# Altium project TEBF0808.PrjPCB (part 1 of 6)
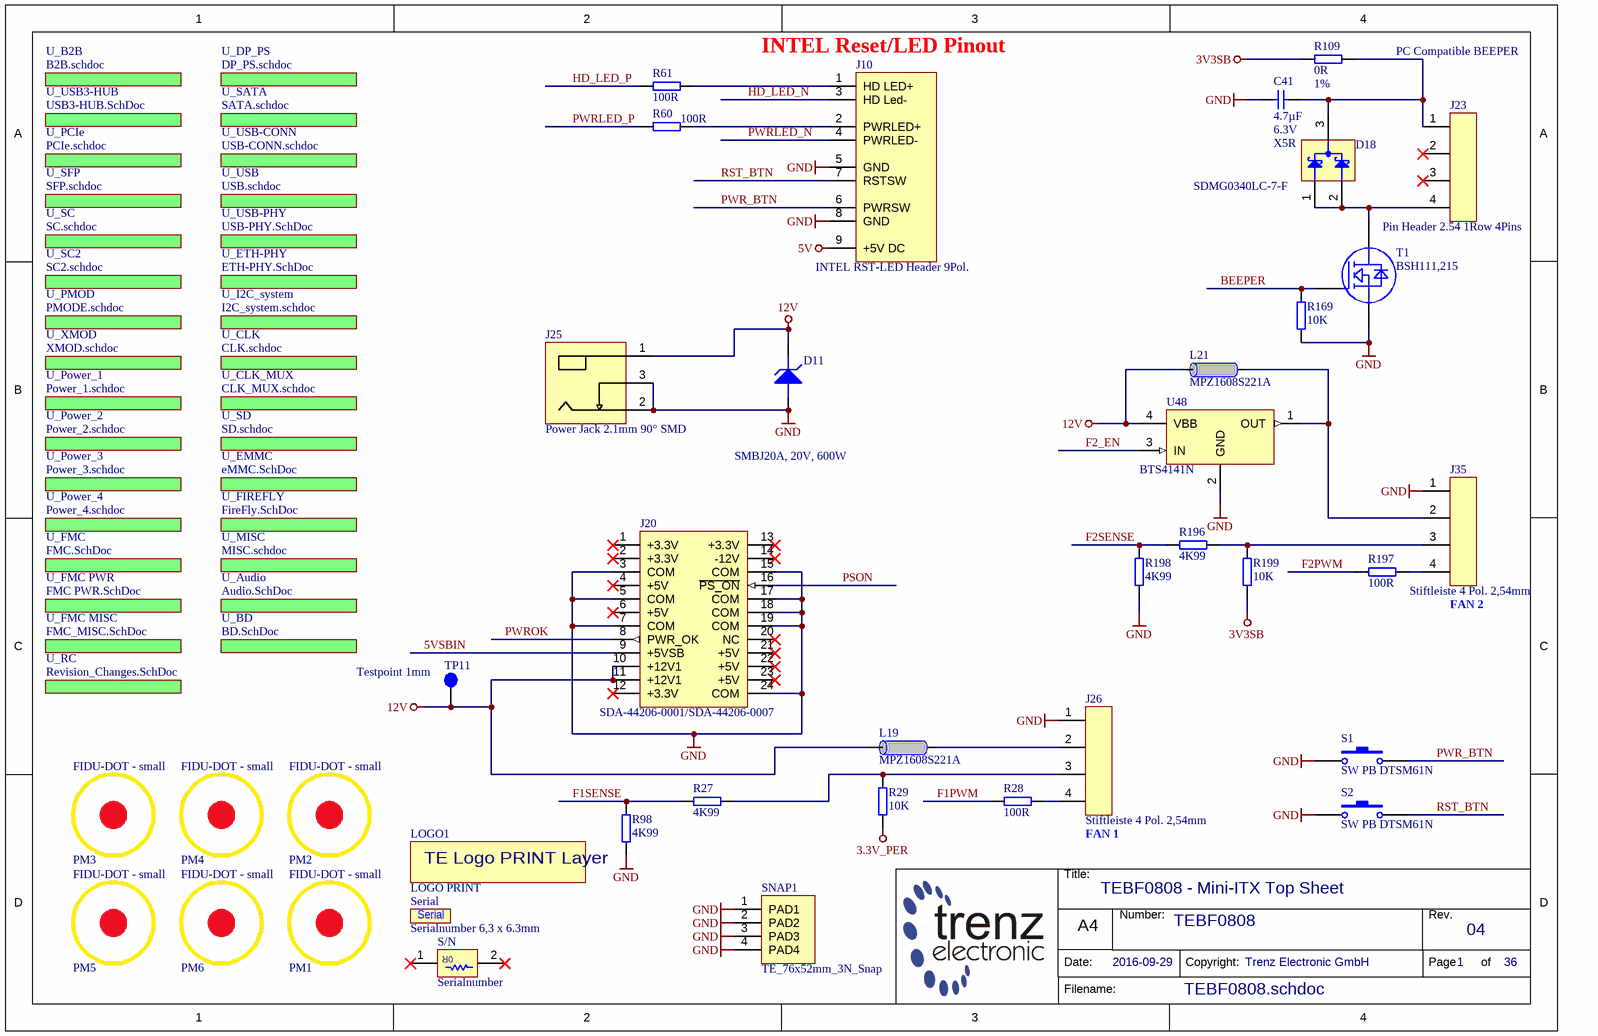
[diagram p0: TEBF0808.schdoc]
ProjectAddress1: IBP Shanghai; ProjectAddress2: Level 3 - Building 3; ProjectAddress3: No.168 Linhong Road; ProjectAddress4: Shanghai 200335, China; ProjectOrganization: Altium; ProjectTitle: Micro ATX Computer motherboard form factor; Template Family: ATX; Template Notes: - Dimensions are in MM, Nominal values used.  - Details about expansion slot locations not included here, see 2.3.1 page 11 for details  - Location of connector I/O area is approximated (front facing area is implementation specific and not defined in standard), see figure 3 page 12  - Component constraints derived from microATX_12_493F9596d01.pdf,page 17  - Please see 2.4.2 in page 17 for bottom side height constraints  - Stackup is not specified in microATX_12_493F9596d01.pdf; Template Revision Date: 29 Oct, 2010; Template Source Document: Outline: microATX_12_493F9596d01.pdf; Template Source Name: microATX; Template Source Organization: Intel; Template Source Revision Date: ver1.2
36 sheets, 609 parts. Net scope: global (net labels, ports and power ports of the same name join across sheets).
Board file: TEBF0808.PcbDoc
Sheets:
  TEBF0808.schdoc
    U_PCIe = PCIe.schdoc
    U_SFP = SFP.schdoc
    U_DP_PS = DP_PS.schdoc
    U_USB-CONN = USB-CONN.schdoc
    U_USB = USB.schdoc
    U_USB-PHY = USB-PHY.SchDoc
    U_ETH-PHY = ETH-PHY.SchDoc
    U_I2C_system = I2C_system.schdoc
    U_CLK = CLK.schdoc
    U_SD = SD.schdoc
    U_SC = SC.schdoc
    U_SC2 = SC2.schdoc
    U_XMOD = XMOD.schdoc
    U_Power_1 = Power_1.schdoc
    U_B2B = B2B.schdoc
      U_J1 = J1.schdoc
      U_J2 = J2.schdoc
      U_J3 = J3.schdoc
      U_J4 = J4.schdoc
    U_USB3-HUB = USB3-HUB.SchDoc
    U_Power_2 = Power_2.schdoc
    U_FMC = FMC.SchDoc
    U_FMC PWR = FMC PWR.SchDoc
    U_Audio = Audio.SchDoc
    U_MISC = MISC.schdoc
    U_EMMC = eMMC.SchDoc
    U_FIREFLY = FireFly.SchDoc
    U_Power_3 = Power_3.schdoc
    U_Power_4 = Power_4.schdoc
    U_CLK_MUX = CLK_MUX.schdoc
    U_FMC MISC = FMC_MISC.SchDoc
    U_BD = BD.SchDoc
    U_PMOD = PMODE.schdoc
    U_SATA = SATA.schdoc
    U_RC = Revision_Changes.SchDoc

## Sheet TEBF0808.schdoc: TEBF0808 - Mini-ITX Top Sheet
size A4; DocumentNumber: TEBF0808; Revision: 04; SheetNumber: 1; SheetTotal: 36; Date: 2016-09-29; CompanyName: Trenz Electronic GmbH; Organization: Trenz Electronic GmbH

### Parts
C41  4.7µF  Voltage: 6.3V  Technology: X5R  [CAPC1005X60N]
D11  SMBJ20A, 20V, 600W  [DIOM5236X261N]
D18  SDMG0340LC-7-F  [SOT65P210X110-3N]
J10  INTEL RST-LED Header 9Pol.  [INTEL_FP_RST_LED_9PIN]
J20  SDA-44206-0001/SDA-44206-0007  [SDA-44206-0001]
J23  Pin Header 2.54 1Row 4Pins  [STIFTLEISTE2_54 OG 1R-4]
J25  Power Jack 2.1mm 90° SMD  [694106106102]
J26  Stiftleiste 4 Pol. 2,54mm  [47053-1000]
J35  Stiftleiste 4 Pol. 2,54mm  [47053-1000]
L19  MPZ1608S221A  [INDC1608X95N]
L21  MPZ1608S221A  [INDC1608X95N]
LOGO1  LOGO PRINT  [LOGO PRINT]  (no BOM)
PM1  FIDU-DOT - small  [FIDU-DOT - small]
PM2  FIDU-DOT - small  [FIDU-DOT - small]
PM3  FIDU-DOT - small  [FIDU-DOT - small]
PM4  FIDU-DOT - small  [FIDU-DOT - small]
PM5  FIDU-DOT - small  [FIDU-DOT - small]
PM6  FIDU-DOT - small  [FIDU-DOT - small]
R27  4K99  [RESC1005X40N]
R28  100R  [RESC1005X40N]
R29  10K  [RESC1005X40N]
R60  100R  [RESC1005X40N]
R61  100R  [RESC1005X40N]
R98  4K99  [RESC1005X40N]
R109  0R  Tolerance: 1%  [RESC1005X40N]
R169  10K  [RESC1005X40N]
R196  4K99  [RESC1005X40N]
R197  100R  [RESC1005X40N]
R198  4K99  [RESC1005X40N]
R199  10K  [RESC1005X40N]
S1  SW PB DTSM61N  [DTSM61N]
S2  SW PB DTSM61N  [DTSM61N]
S/N  Serialnumber  [TraceabilityPad]
Serial  Serialnumber 6,3 x 6.3mm  [Serial_6.3x6.3mm]  (no BOM)
SNAP1  TE_76x52mm_3N_Snap  [TE_76x52mm_Snap]  (no BOM)
T1  BSH111,215  [SOT95P230X109-3N]
TP11  Testpoint 1mm  [TP_1mm]
U48  BTS4141N  [SOT230P700X180-4N]

### Sub-sheets
U_Audio = Audio.SchDoc: no entries
U_B2B = B2B.schdoc: no entries
U_BD = BD.SchDoc: no entries
U_CLK = CLK.schdoc: no entries
U_CLK_MUX = CLK_MUX.schdoc: no entries
U_DP_PS = DP_PS.schdoc: no entries
U_EMMC = eMMC.SchDoc: no entries
U_ETH-PHY = ETH-PHY.SchDoc: no entries
U_FIREFLY = FireFly.SchDoc: no entries
U_FMC = FMC.SchDoc: no entries
U_FMC MISC = FMC_MISC.SchDoc: no entries
U_FMC PWR = FMC PWR.SchDoc: no entries
U_I2C_system = I2C_system.schdoc: no entries
U_MISC = MISC.schdoc: no entries
U_PCIe = PCIe.schdoc: no entries
U_PMOD = PMODE.schdoc: no entries
U_Power_1 = Power_1.schdoc: no entries
U_Power_2 = Power_2.schdoc: no entries
U_Power_3 = Power_3.schdoc: no entries
U_Power_4 = Power_4.schdoc: no entries
U_RC = Revision_Changes.SchDoc: no entries
U_SATA = SATA.schdoc: no entries
U_SC = SC.schdoc: no entries
U_SC2 = SC2.schdoc: no entries
U_SD = SD.schdoc: no entries
U_SFP = SFP.schdoc: no entries
U_USB = USB.schdoc: no entries
U_USB3-HUB = USB3-HUB.SchDoc: no entries
U_USB-CONN = USB-CONN.schdoc: no entries
U_USB-PHY = USB-PHY.SchDoc: no entries
U_XMOD = XMOD.schdoc: no entries

### Nets
3.3V_PER: R29.2
3V3SB: R109.1 R199.2
5V: J10.9(+5V_DC)
12V: D11.1(KATHODE) J20.10(+12V1) J20.11(+12V1) J25.1 L19.2 L21.2 TP11.1 U48.4(VBB)
GND: C41.1 D11.2(ANODE) J10.5(GND) J10.8(GND) J20.3(COM) J20.5(COM) J20.7(COM) J20.15(COM) J20.17(COM) J20.18(COM) J20.19(COM) J20.24(COM) J25.2 J25.3 J26.1 J35.1 R98.2 R169.1 R198.2 S1.1 S2.1 SNAP1.1(PAD1) SNAP1.2(PAD2) SNAP1.3(PAD3) SNAP1.4(PAD4) T1.2(SOURCE) U48.2(GND)
5VSBIN: J20.9(+5VSB)
BEEPER: R169.2 T1.1(GATE)
F1PWM: R28.1
F1SENSE: R27.1 R98.1
F2_EN: U48.3(IN)
F2PWM: R197.1
F2SENSE: R196.1 R198.1
HD_LED_N: J10.3(HD_Led-)
HD_LED_P: R61.1
PSON: J20.16(~{PS_ON})
PWR_BTN: J10.6(PWRSW) S1.2
PWRLED_N: J10.4(PWRLED-)
PWRLED_P: R60.1
PWROK: J20.8(PWR_OK)
RST_BTN: J10.7(RSTSW) S2.2
NetC41_2: C41.2 D18.3(K) J23.1 R109.2
NetD18_1: D18.1(A) D18.2(A) J23.4 T1.3(DRAIN)
NetJ10_1: J10.1(HD_LED+) R61.2
NetJ10_2: J10.2(PWRLED+) R60.2
NetJ26_2: J26.2 L19.1
NetJ26_3: J26.3 R27.2 R29.1
NetJ26_4: J26.4 R28.2
NetJ35_2: J35.2 L21.1 U48.1(OUT)
NetJ35_3: J35.3 R196.2 R199.1
NetJ35_4: J35.4 R197.2

Not connected (* = marked no-connect by the designer): J20 1(+3.3V)* 2(+3.3V)* 4(+5V)* 6(+5V)* 12(+3.3V)* 13(+3.3V)* 14(-12V)* 20(NC)* 21(+5V)* 22(+5V)* 23(+5V)*; J23 2* 3*; S/N 1* 2*

### Notes on the sheet
- (near J10) INTEL Reset/LED Pinout
- PC Compatible BEEPER
- (near J35) FAN 2
- (near J26) FAN 1
- Title:
- Number:
- Rev.
- Date:
- A4
- Copyright:
- Page
- of
- Filename:
- (in symbol 23748) TE Logo PRINT Layer
- (in symbol 27230) 0R

### Library data of the parts
C41 = 24719: KON 4.7µF 6.3V X5R SMD 20%; AN: 24719; Value: 4.7u; Mixed: SMT; Preferred: Yes; Case: 1005 (0402); Tolerance: 20%
D11 = 25534: TVS, Unidirectional, 20V, 600W; AN: 25534; Mixed: SMT; Case: SMB DO-214AA; HelpURL: B:\AD\adlib\datasheet\SMBJ; H-ART: SMBJ20A
D18 = 25051: AN: 25051; Mixed: SMT; Trenz-Stock: Yes; Case: SC70-3 / SOT323; HelpURL: B:\AD\adlib\datasheet\SDMG0340; H-ART: SDMG0340LC-7-F
J10 = 27250: Stiftleiste Intel RST-LED Header 9polig; AN: 27250; Mixed: THT; Trenz-Stock: Yes; HelpURL: B:\AD\adlib\datasheet\INTEL_FP_CON
J20 = 23452: ATX Main Connector 24pol.; AN: 23452; Mixed: THT; Trenz-Stock: Yes; H-ART: 0442060007; Case: MINI-FIT JR. VERTICAL HEADER; HelpURL: B:\AD\adlib\datasheet\ATX-MAIN-24P
J23 = 23162: Stiftleiste gerade 1-reihig, 4pol.; AN: 23162; Mixed: THT; Trenz-Stock: Yes
J25 = 26873: AN: 26873; Mixed: SMT; Trenz-Stock: Yes; HelpURL: B:\ad\adlib\datasheet\694106106102; H-ART: 694106106102
J26 J35 = 24942: Stiftleiste 4 Pol. 7.5mm 2,54mm PC FAN; AN: 24942; Trenz-Stock: Yes; Mixed: THT; HelpURL: B:\AD\adlib\datasheet\47053-1000; H-ART: 47053-1000
L19 L21 = 22718: Ferritdurchführung MPZ1608S221A; AN: 22718; Mixed: SMT; Trenz-Stock: Yes; Value: 220 OHm @ 100MHz; Case: 1608 (0603); HelpURL: B:\AD\adlib\datasheet\MPZ1608; Preferred: Yes; H-ART: MPZ1608S221A
LOGO1 = 23748: AN: 23748
PM1-PM6 = 22905: FIDU-DOT - SMALL 1mm; AN: 22905; Mixed: FIDU
R27 R98 R196 R198 = 22754: WID SMD 4K99 1% 0,063W; AN: 22754; Value: 4.99K; Mixed: SMT; Preferred: Yes; Case: 1005 (0402); Tolerance: 1%; Technology: TK100
R28 R60 R61 R197 = 22507: WID SMD 100R 1% 0,063W; AN: 22507; Mixed: SMT; Value: 100; Preferred: Yes; Case: 1005 (0402); Tolerance: 1%; Technology: TK100
R29 R169 R199 = 22750: WID SMD 10K 1% 0,063W; AN: 22750; Mixed: SMT; Preferred: Yes; Case: 1005 (0402); Value: 10K; Tolerance: 1%; Technology: TK100
R109 = 22738: WID SMD 0R; AN: 22738; Mixed: SMT; Value: 0; Preferred: Yes; Case: 1005 (0402); Technology: TK100
S1 S2 = 22596: Taster Miniatur Leiterplatte 1.6N; AN: 22596; Mixed: SMT; Trenz-Stock: Yes; HelpURL: B:\AD\adlib\datasheet\DTSM; Preferred: Yes; H-ART: DTSM61N
S/N = 27230: AN: 27230; Mixed: SMT; HelpURL: B:\AD\adlib\datasheet\0916580020
Serial = 26753: AN: 26753
SNAP1 = 27115: TE0808 76x52mm Snap; AN: 27115; Mixed: SMT
T1 = 26613: AN: 26613; Mixed: SMT; Trenz-Stock: Yes; Case: SOT23-3; HelpURL: B:\AD\adlib\datasheet\BSH111; Preferred: Yes; H-ART: BSH111,215
TP11 = 25063: AN: 25063; Mixed: SMT
U48 = 27029: AN: 27029; Mixed: SMT; Trenz-Stock: Yes; Case: SOT223-4; HelpURL: B:\AD\adlib\datasheet\BTS4141N; H-ART: BTS4141N

## Sheet PCIe.schdoc: TEBF0808 - PCIe
size A4; DocumentNumber: TEBF0808; Revision: 04; SheetNumber: 7; SheetTotal: 36; Date: 2016-09-29; CompanyName: Trenz Electronic GmbH; Organization: Trenz Electronic GmbH
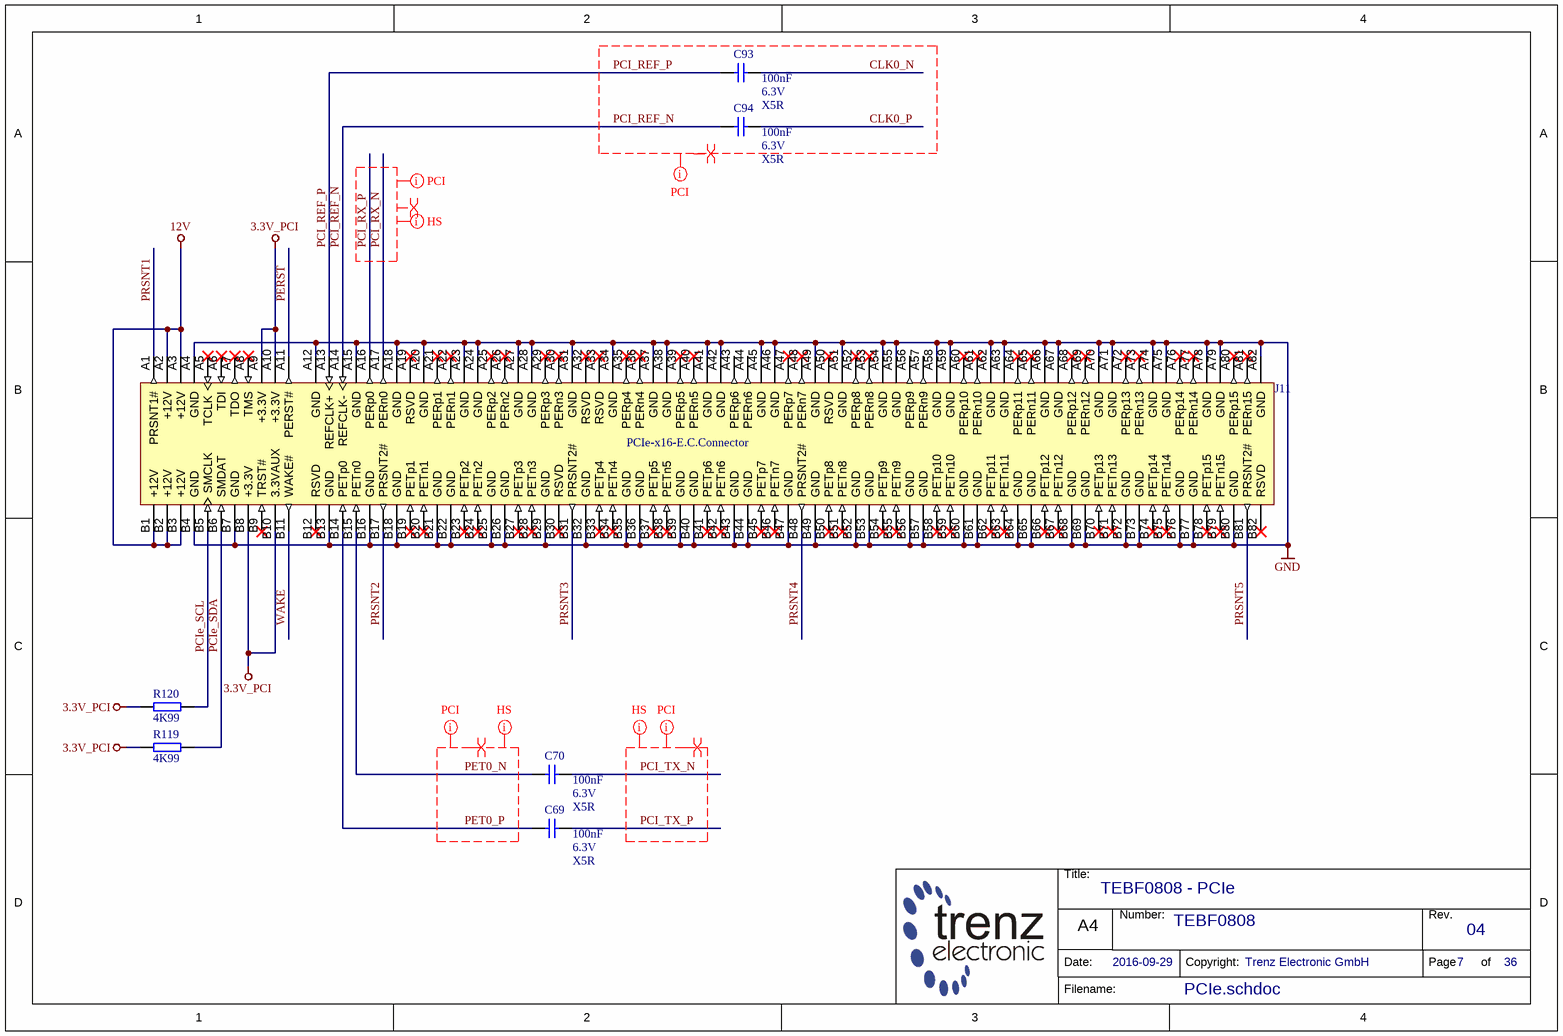
[diagram p1: PCIe.schdoc]

### Parts
C69  100nF  Voltage: 6.3V  Technology: X5R  [CAPC0603X33N]
C70  100nF  Voltage: 6.3V  Technology: X5R  [CAPC0603X33N]
C93  100nF  Voltage: 6.3V  Technology: X5R  [CAPC0603X33N]
C94  100nF  Voltage: 6.3V  Technology: X5R  [CAPC0603X33N]
J11  PCIe-x16-E.C.Connector  [PCIe-x16-E.C.Connector]
R119  4K99  [RESC1005X40N]
R120  4K99  [RESC1005X40N]

### Nets
3.3V_PCI: J11.A9(+3.3V) J11.A10(+3.3V) J11.B8(+3.3V) J11.B10(3.3VAUX) R119.1 R120.1
12V: J11.A2(+12V) J11.A3(+12V) J11.B1(+12V) J11.B2(+12V) J11.B3(+12V)
GND: J11.A4(GND) J11.A12(GND) J11.A15(GND) J11.A18(GND) J11.A20(GND) J11.A23(GND) J11.A24(GND) J11.A27(GND) J11.A28(GND) J11.A31(GND) J11.A34(GND) J11.A37(GND) J11.A38(GND) J11.A41(GND) J11.A42(GND) J11.A45(GND) J11.A46(GND) J11.A49(GND) J11.A51(GND) J11.A54(GND) J11.A55(GND) J11.A58(GND) J11.A59(GND) J11.A62(GND) J11.A63(GND) J11.A66(GND) J11.A67(GND) J11.A70(GND) J11.A71(GND) J11.A74(GND) J11.A75(GND) J11.A78(GND) J11.A79(GND) J11.A82(GND) J11.B4(GND) J11.B7(GND) J11.B13(GND) J11.B16(GND) J11.B18(GND) J11.B21(GND) J11.B22(GND) J11.B25(GND) J11.B26(GND) J11.B29(GND) J11.B32(GND) J11.B35(GND) J11.B36(GND) J11.B39(GND) J11.B40(GND) J11.B43(GND) J11.B44(GND) J11.B47(GND) J11.B49(GND) J11.B52(GND) J11.B53(GND) J11.B56(GND) J11.B57(GND) J11.B60(GND) J11.B61(GND) J11.B64(GND) J11.B65(GND) J11.B68(GND) J11.B69(GND) J11.B72(GND) J11.B73(GND) J11.B76(GND) J11.B77(GND) J11.B80(GND)
CLK0_N: C93.2
CLK0_P: C94.2
PCI_REF_N: C94.1 J11.A14(REFCLK-)
PCI_REF_P: C93.1 J11.A13(REFCLK+)
PCI_RX_N: J11.A17(PERn0)
PCI_RX_P: J11.A16(PERp0)
PCI_TX_N: C70.2
PCI_TX_P: C69.2
PCIe_SCL: J11.B5(SMCLK) R120.2
PCIe_SDA: J11.B6(SMDAT) R119.2
PERST: J11.A11(PERST#)
PET0_N: C70.1 J11.B15(PETn0)
PET0_P: C69.1 J11.B14(PETp0)
PRSNT1: J11.A1(PRSNT1#)
PRSNT2: J11.B17(PRSNT2#)
PRSNT3: J11.B31(PRSNT2#)
PRSNT4: J11.B48(PRSNT2#)
PRSNT5: J11.B81(PRSNT2#)
WAKE: J11.B11(WAKE#)

Not connected (* = marked no-connect by the designer): J11 A5(TCLK)* A6(TDI)* A7(TDO)* A8(TMS)* A19(RSVD)* A21(PERp1)* A22(PERn1)* A25(PERp2)* A26(PERn2)* A29(PERp3)* A30(PERn3)* A32(RSVD)* A33(RSVD)* A35(PERp4)* A36(PERn4)* A39(PERp5)* A40(PERn5)* A43(PERp6) A44(PERn6) A47(PERp7)* A48(PERn7)* A50(RSVD)* A52(PERp8)* A53(PERn8)* A56(PERp9) A57(PERn9) A60(PERp10)* A61(PERn10)* A64(PERp11)* A65(PERn11)* A68(PERp12)* A69(PERn12)* A72(PERp13)* A73(PERn13)* A76(PERp14)* A77(PERn14)* A80(PERp15)* A81(PERn15)* B9(TRST#)* B12(RSVD)* B19(PETp1)* B20(PETn1)* B23(PETp2)* B24(PETn2)* B27(PETp3)* B28(PETn3)* B30(RSVD)* B33(PETp4)* B34(PETn4)* B37(PETp5)* B38(PETn5)* B41(PETp6)* B42(PETn6)* B45(PETp7)* B46(PETn7)* B50(PETp8)* B51(PETn8)* B54(PETp9)* B55(PETn9)* B58(PETp10)* B59(PETn10)* B62(PETp11)* B63(PETn11)* B66(PETp12)* B67(PETn12)* B70(PETp13)* B71(PETn13)* B74(PETp14)* B75(PETn14)* B78(PETp15)* B79(PETn15)* B82(RSVD)*

### Layout directives
differential pair: CLK0_N, CLK0_P, PCI_REF_N, PCI_REF_P, PCI_RX_N, PCI_RX_P, PCI_TX_N, PCI_TX_P, PET0_N, PET0_P
net class PCI: CLK0_N, CLK0_P, PCI_REF_N, PCI_REF_P, PCI_RX_N, PCI_RX_P, PCI_TX_N, PCI_TX_P, PET0_N, PET0_P
net class HS: PCI_RX_N, PCI_RX_P, PCI_TX_N, PCI_TX_P, PET0_N, PET0_P

### Notes on the sheet
- Title:
- Number:
- Rev.
- Date:
- A4
- Copyright:
- Page
- of
- Filename:

### Library data of the parts
C69 C70 C93 C94 = 24915: KON 100nF 6.3V X5R SMD 10%; AN: 24915; Mixed: SMT; Value: 100n; Preferred: Yes; Case: 0603 (0201); Tolerance: 10%
J11 = 23437: PCIe-x16, 30µin, Twin Plastic, Black; AN: 23437; Mixed: THT; Trenz-Stock: Yes; Case: PCIe-x16; HelpURL: B:\AD\adlib\datasheet\PCIe-x16-E.C.Connector
R119 R120 = 22754: as R27 on sheet TEBF0808; Case: 1005 (0402); Tolerance: 1%; Technology: TK100

## Sheet SFP.schdoc: TEBF0808 - SFP
size A4; DocumentNumber: TEBF0808; Revision: 04; SheetNumber: 9; SheetTotal: 36; Date: 2016-09-29; CompanyName: Trenz Electronic GmbH; Organization: Trenz Electronic GmbH
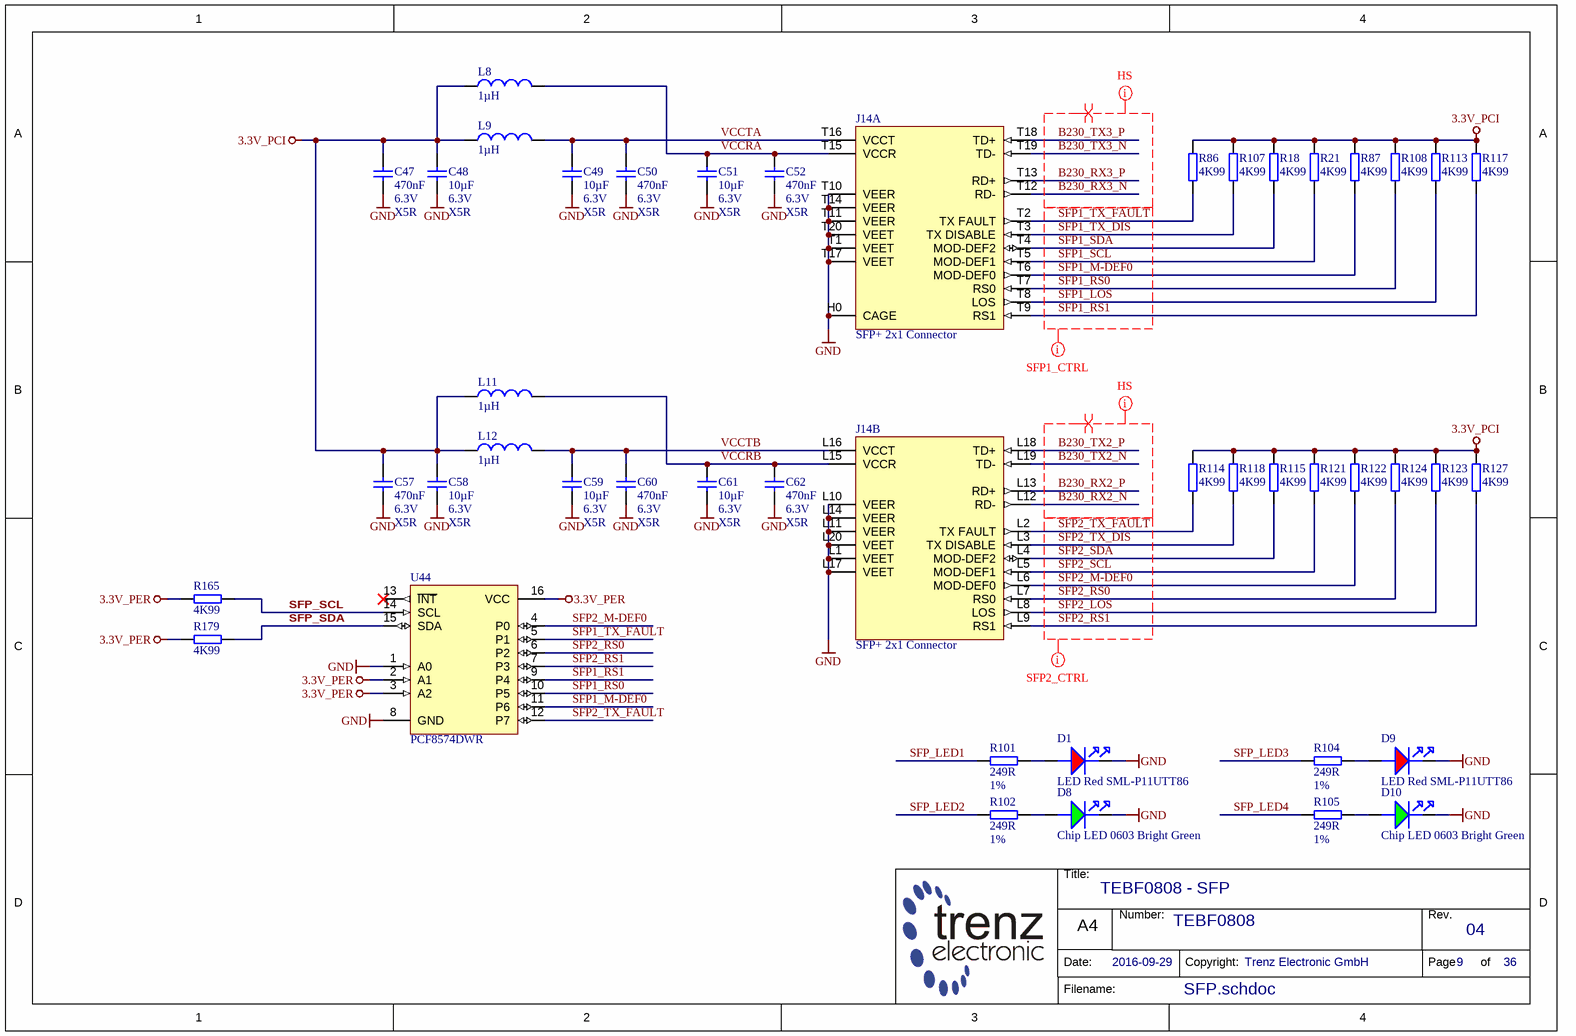
[diagram p2: SFP.schdoc]

### Parts
C47  470nF  Voltage: 6.3V  Technology: X5R  [CAPC1005X55N]
C48  10µF  Voltage: 6.3V  Technology: X5R  [CAPC1608X90N]
C49  10µF  Voltage: 6.3V  Technology: X5R  [CAPC1608X90N]
C50  470nF  Voltage: 6.3V  Technology: X5R  [CAPC1005X55N]
C51  10µF  Voltage: 6.3V  Technology: X5R  [CAPC1608X90N]
C52  470nF  Voltage: 6.3V  Technology: X5R  [CAPC1005X55N]
C57  470nF  Voltage: 6.3V  Technology: X5R  [CAPC1005X55N]
C58  10µF  Voltage: 6.3V  Technology: X5R  [CAPC1608X90N]
C59  10µF  Voltage: 6.3V  Technology: X5R  [CAPC1608X90N]
C60  470nF  Voltage: 6.3V  Technology: X5R  [CAPC1005X55N]
C61  10µF  Voltage: 6.3V  Technology: X5R  [CAPC1608X90N]
C62  470nF  Voltage: 6.3V  Technology: X5R  [CAPC1005X55N]
D1  LED Red SML-P11UTT86  [LEDC1006X25N_RED]
D8  Chip LED 0603 Bright Green  [chipLED_0603_Green]
D9  LED Red SML-P11UTT86  [LEDC1006X25N_RED]
D10  Chip LED 0603 Bright Green  [chipLED_0603_Green]
J14  SFP+ 2x1 Connector  [1-2007492-5]  (parts A,B of 2)
L8  1µH  [INDC2520X100N]
L9  1µH  [INDC2520X100N]
L11  1µH  [INDC2520X100N]
L12  1µH  [INDC2520X100N]
R18  4K99  [RESC1005X40N]
R21  4K99  [RESC1005X40N]
R86  4K99  [RESC1005X40N]
R87  4K99  [RESC1005X40N]
R101  249R  Tolerance: 1%  [RESC1005X40N]
R102  249R  Tolerance: 1%  [RESC1005X40N]
R104  249R  Tolerance: 1%  [RESC1005X40N]
R105  249R  Tolerance: 1%  [RESC1005X40N]
R107  4K99  [RESC1005X40N]
R108  4K99  [RESC1005X40N]
R113  4K99  [RESC1005X40N]
R114  4K99  [RESC1005X40N]
R115  4K99  [RESC1005X40N]
R117  4K99  [RESC1005X40N]
R118  4K99  [RESC1005X40N]
R121  4K99  [RESC1005X40N]
R122  4K99  [RESC1005X40N]
R123  4K99  [RESC1005X40N]
R124  4K99  [RESC1005X40N]
R127  4K99  [RESC1005X40N]
R165  4K99  [RESC1005X40N]
R179  4K99  [RESC1005X40N]
U44  PCF8574DWR  [SOIC127P1030X265-16N]

### Nets
3.3V_PCI: C47.1 C48.1 C57.1 C58.1 L8.1 L9.1 L11.1 L12.1 R18.2 R21.2 R86.2 R87.2 R107.2 R108.2 R113.2 R114.2 R115.2 R117.2 R118.2 R121.2 R122.2 R123.2 R124.2 R127.2
3.3V_PER: R165.1 R179.1 U44.2(A1) U44.3(A2) U44.16(VCC)
GND: C47.2 C48.2 C49.2 C50.2 C51.2 C52.2 C57.2 C58.2 C59.2 C60.2 C61.2 C62.2 D1.K D8.K D9.K D10.K J14.H0(CAGE) J14.L1(VEET) J14.L10(VEER) J14.L11(VEER) J14.L14(VEER) J14.L17(VEET) J14.L20(VEET) J14.T1(VEET) J14.T10(VEER) J14.T11(VEER) J14.T14(VEER) J14.T17(VEET) J14.T20(VEET) U44.1(A0) U44.8(GND)
B230_RX2_N: J14.L12(RD-)
B230_RX2_P: J14.L13(RD+)
B230_RX3_N: J14.T12(RD-)
B230_RX3_P: J14.T13(RD+)
B230_TX2_N: J14.L19(TD-)
B230_TX2_P: J14.L18(TD+)
B230_TX3_N: J14.T19(TD-)
B230_TX3_P: J14.T18(TD+)
SFP1_LOS: J14.T8(LOS) R113.1
SFP1_M-DEF0: J14.T6(MOD-DEF0) R87.1 U44.11(P6)
SFP1_RS0: J14.T7(RS0) R108.1 U44.10(P5)
SFP1_RS1: J14.T9(RS1) R117.1 U44.9(P4)
SFP1_SCL: J14.T5(MOD-DEF1) R21.1
SFP1_SDA: J14.T4(MOD-DEF2) R18.1
SFP1_TX_DIS: J14.T3(TX_DISABLE) R107.1
SFP1_TX_FAULT: J14.T2(TX_FAULT) R86.1 U44.5(P1)
SFP2_LOS: J14.L8(LOS) R123.1
SFP2_M-DEF0: J14.L6(MOD-DEF0) R122.1 U44.4(P0)
SFP2_RS0: J14.L7(RS0) R124.1 U44.6(P2)
SFP2_RS1: J14.L9(RS1) R127.1 U44.7(P3)
SFP2_SCL: J14.L5(MOD-DEF1) R121.1
SFP2_SDA: J14.L4(MOD-DEF2) R115.1
SFP2_TX_DIS: J14.L3(TX_DISABLE) R118.1
SFP2_TX_FAULT: J14.L2(TX_FAULT) R114.1 U44.12(P7)
SFP_LED1: R101.1
SFP_LED2: R102.1
SFP_LED3: R104.1
SFP_LED4: R105.1
SFP_SCL: R165.2 U44.14(SCL)
SFP_SDA: R179.2 U44.15(SDA)
VCCRA: C51.1 C52.1 J14.T15(VCCR) L8.2
VCCRB: C61.1 C62.1 J14.L15(VCCR) L11.2
VCCTA: C49.1 C50.1 J14.T16(VCCT) L9.2
VCCTB: C59.1 C60.1 J14.L16(VCCT) L12.2
NetD1_A: D1.A R101.2
NetD8_A: D8.A R102.2
NetD9_A: D9.A R104.2
NetD10_A: D10.A R105.2

Not connected (* = marked no-connect by the designer): U44 13(~{INT})*

### Layout directives
net class SFP1_CTRL: SFP1_LOS, SFP1_M-DEF0, SFP1_RS0, SFP1_RS1, SFP1_SCL, SFP1_SDA, SFP1_TX_DIS, SFP1_TX_FAULT
differential pair: B230_RX2_N, B230_RX2_P, B230_RX3_N, B230_RX3_P, B230_TX2_N, B230_TX2_P, B230_TX3_N, B230_TX3_P
net class SFP2_CTRL: SFP2_LOS, SFP2_M-DEF0, SFP2_RS0, SFP2_RS1, SFP2_SCL, SFP2_SDA, SFP2_TX_DIS, SFP2_TX_FAULT
net class HS: B230_RX2_N, B230_RX2_P, B230_RX3_N, B230_RX3_P, B230_TX2_N, B230_TX2_P, B230_TX3_N, B230_TX3_P

### Notes on the sheet
- Title:
- Number:
- Rev.
- Date:
- A4
- Copyright:
- Page
- of
- Filename:

### Library data of the parts
C47 C50 C52 C57 C60 C62 = 23659: KON 470nF 6,3V X5R SMD; AN: 23659; Mixed: SMT; Value: 470n; Preferred: Yes; Case: 1005 (0402)
C48 C49 C51 C58 C59 C61 = 22918: KON 10µF 6,3V X5R SMD; AN: 22918; Mixed: SMT; Value: 10u; Case: 1608 (0603)
D1 D9 = 24212: LED Rot SML-P11UTT86 SMD; AN: 24212; Mixed: SMT; Preferred: Yes; Case: 1005 (0402); HelpURL: B:\AD\adlib\datasheet\SML-P1; H-ART: SML-P11UTT86
D8 D10 = 25986: AN: 25986; Voltage: 2.0; Mixed: SMT; Preferred: Yes; H-ART: 150 060 VS7 500 0; Case: 0603; HelpURL: B:\AD\adlib\datasheet\WL_SMCW
J14 = 27231: SFP+ 2x1 Connector  Sp Fing 4LP EMI Enhanced; AN: 27231; Mixed: THT; Trenz-Stock: Yes; HelpURL: B:\AD\adlib\datasheet\1-2007492-5; H-ART: 1-2007492-5
L8 L9 L11 L12 = 25265: IND SMD 1µH +-20% 0.055Ohm; AN: 25265; Value: 1u; Trenz-Stock: Yes; Voltage: 1.7A; Mixed: SMT; H-ART: 74479787210a; Case: WE-PMI 2520(1008); HelpURL: B:\AD\adlib\datasheet\74479787210a; Technology: 0.055Ohm
R18 R21 R86 R87 R107 R108 R113-R115 R117 R118 R121-R124 R127 = 22754: WID SMD 4K99 1% 0,063W; AN: 22754; Mixed: SMT; Value: 4.99K; Preferred: Yes; Case: 1005 (0402); Tolerance: 1%; Technology: TK100
R101 R102 R104 R105 = 22740: WID SMD 249R 1% 0,063W; AN: 22740; Mixed: SMT; Value: 249; Preferred: Yes; Case: 1005 (0402); Technology: TK100
R165 R179 = 22754: as R27 on sheet TEBF0808; Case: 1005 (0402); Tolerance: 1%; Technology: TK100
U44 = 26502: AN: 26502; Mixed: SMT; Case: SO16W DW; HelpURL: B:\AD\adlib\datasheet\PCF8574; H-ART: PCF8574DWR

## Sheet DP_PS.schdoc: TEBF0808 - DisplayPort
size A4; DocumentNumber: TEBF0808; Revision: 04; SheetNumber: 10; SheetTotal: 36; Date: 2016-09-29; CompanyName: Trenz Electronic GmbH; Organization: Trenz Electronic GmbH
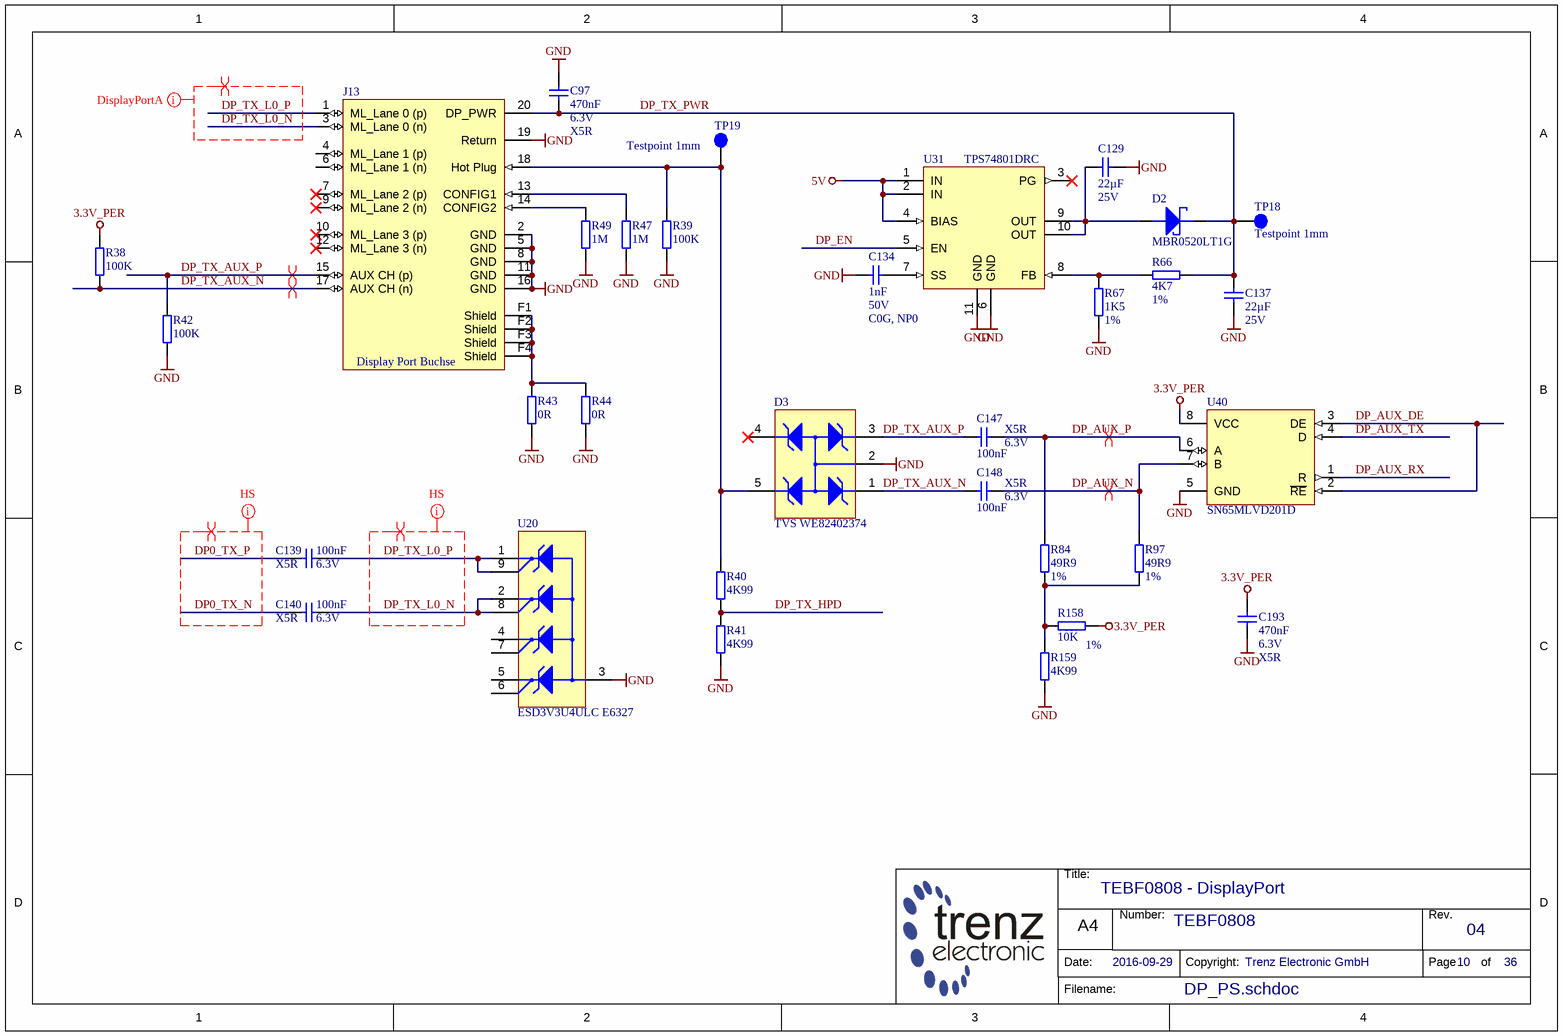
[diagram p3: DP_PS.schdoc]

### Parts
C97  470nF  Voltage: 6.3V  Technology: X5R  [CAPC1005X55N]
C129  22µF  Voltage: 25V  [CAPC3216X180N]
C134  1nF  Voltage: 50V  Technology: C0G, NP0  [CAPC1005X55N]
C137  22µF  Voltage: 25V  [CAPC3216X180N]
C139  100nF  Voltage: 6.3V  Technology: X5R  [CAPC0603X33N]
C140  100nF  Voltage: 6.3V  Technology: X5R  [CAPC0603X33N]
C147  100nF  Voltage: 6.3V  Technology: X5R  [CAPC0603X33N]
C148  100nF  Voltage: 6.3V  Technology: X5R  [CAPC0603X33N]
C193  470nF  Voltage: 6.3V  Technology: X5R  [CAPC1005X55N]
D2  MBR0520LT1G  [SOD3816X120N]
D3  TVS WE82402374  [SOT65P210X110-5N]
J13  Display Port Buchse  [8470-2-2-X]
R38  100K  [RESC1005X40N]
R39  100K  [RESC1005X40N]
R40  4K99  [RESC1005X40N]
R41  4K99  [RESC1005X40N]
R42  100K  [RESC1005X40N]
R43  0R  [RESC1005X40N]
R44  0R  [RESC1005X40N]
R47  1M  [RESC1005X40N]
R49  1M  [RESC1005X40N]
R66  4K7  Tolerance: 1%  [RESC1005X40N]
R67  1K5  Tolerance: 1%  [RESC1005X40N]
R84  49R9  Tolerance: 1%  [RESC1005X40N]
R97  49R9  Tolerance: 1%  [RESC1005X40N]
R158  10K  Tolerance: 1%  [RESC1005X40N]
R159  4K99  [RESC1005X40N]
TP18  Testpoint 1mm  [TP_1mm]
TP19  Testpoint 1mm  [TP_1mm]
U20  ESD3V3U4ULC E6327  [TSLP-9-1]
U31  TPS74801DRC  [SON50P300X300X100-11N-TI]
U40  SN65MLVD201D  [SOIC127P600X175-8N]

### Nets
3.3V_PER: C193.1 R38.1 R158.1 U40.8(VCC)
5V: U31.1(IN) U31.2(IN) U31.4(BIAS)
GND: C97.2 C129.2 C134.1 C137.1 C193.2 D3.2 J13.2(GND) J13.5(GND) J13.8(GND) J13.11(GND) J13.16(GND) J13.19(Return) R39.2 R41.1 R42.2 R43.1 R44.1 R47.1 R49.2 R67.2 R159.1 U20.3 U31.6(GND) U31.11(GND) U40.5(GND)
DP0_TX_N: C140.1
DP0_TX_P: C139.1
DP_AUX_DE: U40.2(~{RE}) U40.3(DE)
DP_AUX_N: C148.2 R97.1 U40.7(B)
DP_AUX_P: C147.2 R84.1 U40.6(A)
DP_AUX_RX: U40.1(R)
DP_AUX_TX: U40.4(D)
DP_EN: U31.5(EN)
DP_TX_AUX_N: C148.1 D3.1 J13.17(AUX CH (n)) R38.2
DP_TX_AUX_P: C147.1 D3.3 J13.15(AUX CH (p)) R42.1
DP_TX_HPD: R40.1 R41.2
DP_TX_L0_N: C140.2 J13.3(ML_Lane 0 (n)) U20.2 U20.8
DP_TX_L0_P: C139.2 J13.1(ML_Lane 0 (p)) U20.1 U20.9
DP_TX_PWR: C97.1 C137.2 D2.1(KATHODE) J13.20(DP_PWR) R66.2 TP18.1
NetC129_1: C129.1 D2.2(ANODE) U31.9(OUT) U31.10(OUT)
NetC134_2: C134.2 U31.7(SS)
NetD3_5: D3.5 J13.18(Hot Plug) R39.1 R40.2 TP19.1
NetJ13_13: J13.13(CONFIG1) R47.2
NetJ13_14: J13.14(CONFIG2) R49.1
NetJ13_F1: J13.F1(Shield) J13.F2(Shield) J13.F3(Shield) J13.F4(Shield) R43.2 R44.2
NetR66_1: R66.1 R67.1 U31.8(FB)
NetR84_2: R84.2 R97.2 R158.2 R159.2

Not connected (* = marked no-connect by the designer): D3 4*; J13 4(ML_Lane 1 (p)) 6(ML_Lane 1 (n)) 7(ML_Lane 2 (p))* 9(ML_Lane 2 (n))* 10(ML_Lane 3 (p))* 12(ML_Lane 3 (n))*; U20 4 5 6 7; U31 3(PG)*

### Layout directives
differential pair: DP0_TX_N, DP0_TX_P, DP_AUX_N, DP_AUX_P, DP_TX_AUX_N, DP_TX_AUX_P, DP_TX_L0_N, DP_TX_L0_P
net class DisplayPortA: DP_TX_L0_N, DP_TX_L0_P
net class HS: DP0_TX_N, DP0_TX_P, DP_TX_L0_N, DP_TX_L0_P

### Notes on the sheet
- Title:
- Number:
- Rev.
- Date:
- A4
- Copyright:
- Page
- of
- Filename:

### Library data of the parts
C97 C193 = 23659: KON 470nF 6,3V X5R SMD; AN: 23659; Value: 470n; Mixed: SMT; Preferred: Yes; Case: 1005 (0402)
C129 C137 = 24886: KON 22µF X5R 25V SMD 10%; AN: 24886; Value: 22u; Mixed: SMT; Preferred: Yes; Case: 3216 (1206); Tolerance: 10%
C134 = 23752: KON 1nF NP0 SMD 5%; AN: 23752; Mixed: SMT; Value: 1n; Case: 1005 (0402); Tolerance: 5%
C139 C140 C147 C148 = 24915: as C69 on sheet PCIe; Case: 0603 (0201); Tolerance: 10%
D2 = 26768: AN: 26768; Voltage: 0.5A; Mixed: SMT; Value: 20V; Case: SOD123-FC; HelpURL: B:\AD\adlib\datasheet\MBR0520; H-ART: MBR0520LT1G
D3 = 25362: WE-TVS Array 82402374; AN: 25362; Mixed: SMT; Case: SC70-5; HelpURL: B:\AD\adlib\datasheet\82402374; H-ART: 82402374
J13 = 23865: DisplayPort Verbinder, Buchse liegend; AN: 23865; Mixed: SMT; Trenz-Stock: Yes; H-ART: 0472720001; HelpURL: B:\AD\adlib\datasheet\DisplayPort
R38 R39 R42 = 22558: WID SMD 100K 1% 0,063W; AN: 22558; Mixed: SMT; Preferred: Yes; Tolerance: 1%; Case: 1005 (0402); Technology: TK100; Value: 100K
R40 R41 R159 = 22754: as R18 on sheet SFP; Case: 1005 (0402); Tolerance: 1%; Technology: TK100
R43 R44 = 22738: WID SMD 0R; AN: 22738; Tolerance: 1%; Mixed: SMT; Value: 0; Preferred: Yes; Case: 1005 (0402); Technology: TK100
R47 R49 = 22599: WID SMD 1M 1% 0,063W; AN: 22599; Mixed: SMT; Tolerance: 1%; Case: 1005 (0402); Technology: TK100; Value: 1M
R66 = 22585: WID SMD 4K7 1% 0,063W; AN: 22585; Mixed: SMT; Value: 4.7K; Preferred: Yes; Case: 1005 (0402); Technology: TK100
R67 = 22602: WID SMD 1K5 1% 0,063W; AN: 22602; Mixed: SMT; Value: 1.5K; Preferred: Yes; Case: 1005 (0402); Technology: TK100
R84 R97 = 23135: WID SMD 49R9 1% 0,063W; AN: 23135; Mixed: SMT; Value: 49.9; Preferred: Yes; Case: 1005 (0402); Technology: TK100
R158 = 22750: as R29 on sheet TEBF0808; Case: 1005 (0402); Technology: TK100; Value: 10K
TP18 TP19 = 25063: AN: 25063; Mixed: SMT
U20 = 25369: TVS UL Cap. 4xIOs ESD 3.3V; AN: 25369; Mixed: SMT; Case: TSLP-9-1; HelpURL: B:\AD\adlib\datasheet\ESD3V3U4ULC; H-ART: ESD3V3U4ULC E6327
U31 = 25235: AN: 25235; Mixed: SMT; Trenz-Stock: Yes; Case: DRC (S-PVSON-N10); HelpURL: B:\AD\adlib\datasheet\TPS74801; H-ART: TPS74801DRC
U40 = 26577: AN: 26577; Mixed: SMT; Trenz-Stock: Yes; Case: SO8; HelpURL: B:\ad\adlib\datasheet\SN65MLVD201D; H-ART: SN65MLVD201D

## Sheet USB-CONN.schdoc: TEBF0808 - USB Connectors
size A4; DocumentNumber: TEBF0808; Revision: 04; SheetNumber: 16; SheetTotal: 36; Date: 2016-09-29; CompanyName: Trenz Electronic GmbH; Organization: Trenz Electronic GmbH
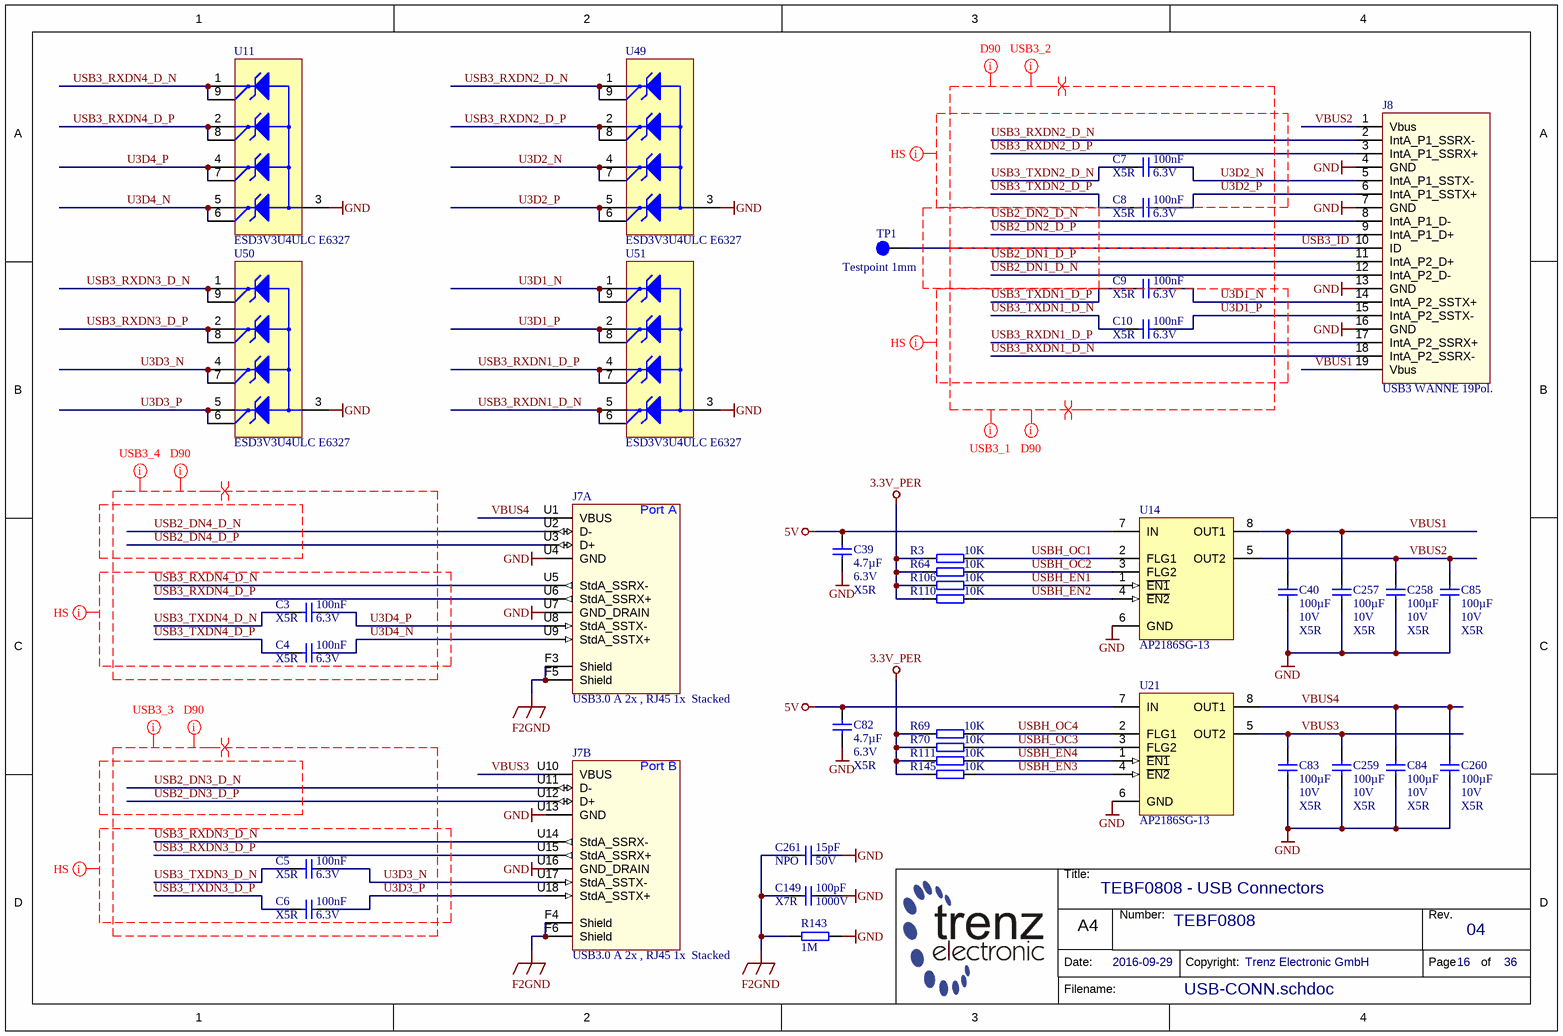
[diagram p4: USB-CONN.schdoc]

### Parts
C3  100nF  Voltage: 6.3V  Technology: X5R  [CAPC0603X33N]
C4  100nF  Voltage: 6.3V  Technology: X5R  [CAPC0603X33N]
C5  100nF  Voltage: 6.3V  Technology: X5R  [CAPC0603X33N]
C6  100nF  Voltage: 6.3V  Technology: X5R  [CAPC0603X33N]
C7  100nF  Voltage: 6.3V  Technology: X5R  [CAPC0603X33N]
C8  100nF  Voltage: 6.3V  Technology: X5R  [CAPC0603X33N]
C9  100nF  Voltage: 6.3V  Technology: X5R  [CAPC0603X33N]
C10  100nF  Voltage: 6.3V  Technology: X5R  [CAPC0603X33N]
C39  4.7µF  Voltage: 6.3V  Technology: X5R  [CAPC1005X60N]
C40  100µF  Voltage: 10V  Technology: X5R  [CAPC3216X180N]
C82  4.7µF  Voltage: 6.3V  Technology: X5R  [CAPC1005X60N]
C83  100µF  Voltage: 10V  Technology: X5R  [CAPC3216X180N]
C84  100µF  Voltage: 10V  Technology: X5R  [CAPC3216X180N]
C85  100µF  Voltage: 10V  Technology: X5R  [CAPC3216X180N]
C149  100pF  Voltage: X7R  Technology: 1000V  [CAPC3216X180N]
C257  100µF  Voltage: 10V  Technology: X5R  [CAPC3216X180N]
C258  100µF  Voltage: 10V  Technology: X5R  [CAPC3216X180N]
C259  100µF  Voltage: 10V  Technology: X5R  [CAPC3216X180N]
C260  100µF  Voltage: 10V  Technology: X5R  [CAPC3216X180N]
C261  15pF  Voltage: 50V  Technology: NPO  [CAPC1005X55N]
J7  USB3.0 A 2x , RJ45 1x  Stacked  [7497110616]  (parts A,B of 5)
J8  USB3 WANNE 19Pol.  [WANNE2mm2R-19_Intel_USB]
R3  10K  [RESC1005X40N]
R64  10K  [RESC1005X40N]
R69  10K  [RESC1005X40N]
R70  10K  [RESC1005X40N]
R106  10K  [RESC1005X40N]
R110  10K  [RESC1005X40N]
R111  10K  [RESC1005X40N]
R143  1M  [RESC3216X65N]
R145  10K  [RESC1005X40N]
TP1  Testpoint 1mm  [TP_1mm]
U11  ESD3V3U4ULC E6327  [TSLP-9-1]
U14  AP2186SG-13  [SOIC127P600X175-8N]
U21  AP2186SG-13  [SOIC127P600X175-8N]
U49  ESD3V3U4ULC E6327  [TSLP-9-1]
U50  ESD3V3U4ULC E6327  [TSLP-9-1]
U51  ESD3V3U4ULC E6327  [TSLP-9-1]

### Nets
3.3V_PER: R3.1 R64.1 R69.1 R70.1 R106.1 R110.1 R111.1 R145.1
5V: C39.1 C82.1 U14.7(IN) U21.7(IN)
F2GND: C149.1 C261.1 J7.F3(Shield) J7.F4(Shield) J7.F5(Shield) J7.F6(Shield) R143.1
GND: C39.2 C40.2 C82.2 C83.2 C84.2 C85.2 C149.2 C257.2 C258.2 C259.2 C260.2 C261.2 J7.U4(GND) J7.U7(GND_DRAIN) J7.U13(GND) J7.U16(GND_DRAIN) J8.4(GND) J8.7(GND) J8.13(GND) J8.16(GND) R143.2 U11.3 U14.6(GND) U21.6(GND) U49.3 U50.3 U51.3
U3D1_N: C9.2 J8.14(IntA_P2_SSTX+) U51.1 U51.9
U3D1_P: C10.2 J8.15(IntA_P2_SSTX-) U51.2 U51.8
U3D2_N: C7.2 J8.5(IntA_P1_SSTX-) U49.4 U49.7
U3D2_P: C8.2 J8.6(IntA_P1_SSTX+) U49.5 U49.6
U3D3_N: C5.2 J7.U17(StdA_SSTX-) U50.4 U50.7
U3D3_P: C6.2 J7.U18(StdA_SSTX+) U50.5 U50.6
U3D4_N: C4.2 J7.U9(StdA_SSTX+) U11.5 U11.6
U3D4_P: C3.2 J7.U8(StdA_SSTX-) U11.4 U11.7
USB2_DN1_D_N: J8.12(IntA_P2_D-)
USB2_DN1_D_P: J8.11(IntA_P2_D+)
USB2_DN2_D_N: J8.8(IntA_P1_D-)
USB2_DN2_D_P: J8.9(IntA_P1_D+)
USB2_DN3_D_N: J7.U11(D-)
USB2_DN3_D_P: J7.U12(D+)
USB2_DN4_D_N: J7.U2(D-)
USB2_DN4_D_P: J7.U3(D+)
USB3_ID: J8.10(ID) TP1.1
USB3_RXDN1_D_N: J8.18(IntA_P2_SSRX-) U51.5 U51.6
USB3_RXDN1_D_P: J8.17(IntA_P2_SSRX+) U51.4 U51.7
USB3_RXDN2_D_N: J8.2(IntA_P1_SSRX-) U49.1 U49.9
USB3_RXDN2_D_P: J8.3(IntA_P1_SSRX+) U49.2 U49.8
USB3_RXDN3_D_N: J7.U14(StdA_SSRX-) U50.1 U50.9
USB3_RXDN3_D_P: J7.U15(StdA_SSRX+) U50.2 U50.8
USB3_RXDN4_D_N: J7.U5(StdA_SSRX-) U11.1 U11.9
USB3_RXDN4_D_P: J7.U6(StdA_SSRX+) U11.2 U11.8
USB3_TXDN1_D_N: C10.1
USB3_TXDN1_D_P: C9.1
USB3_TXDN2_D_N: C7.1
USB3_TXDN2_D_P: C8.1
USB3_TXDN3_D_N: C5.1
USB3_TXDN3_D_P: C6.1
USB3_TXDN4_D_N: C3.1
USB3_TXDN4_D_P: C4.1
USBH_EN1: R106.2 U14.1(~{EN1})
USBH_EN2: R110.2 U14.4(~{EN2})
USBH_EN3: R145.2 U21.4(~{EN2})
USBH_EN4: R111.2 U21.1(~{EN1})
USBH_OC1: R3.2 U14.2(FLG1)
USBH_OC2: R64.2 U14.3(FLG2)
USBH_OC3: R70.2 U21.3(FLG2)
USBH_OC4: R69.2 U21.2(FLG1)
VBUS1: C40.1 C257.1 J8.19(Vbus) U14.8(OUT1)
VBUS2: C85.1 C258.1 J8.1(Vbus) U14.5(OUT2)
VBUS3: C83.1 C259.1 J7.U10(VBUS) U21.5(OUT2)
VBUS4: C84.1 C260.1 J7.U1(VBUS) U21.8(OUT1)

### Layout directives
net class USB3_3: U3D3_N, U3D3_P, USB2_DN3_D_N, USB2_DN3_D_P, USB3_RXDN3_D_N, USB3_RXDN3_D_P, USB3_TXDN3_D_N, USB3_TXDN3_D_P
net class USB3_4: U3D4_N, U3D4_P, USB2_DN4_D_N, USB2_DN4_D_P, USB3_RXDN4_D_N, USB3_RXDN4_D_P, USB3_TXDN4_D_N, USB3_TXDN4_D_P
differential pair: U3D1_N, U3D1_P, U3D2_N, U3D2_P, U3D3_N, U3D3_P, U3D4_N, U3D4_P, USB2_DN1_D_N, USB2_DN1_D_P, USB2_DN2_D_N, USB2_DN2_D_P, USB2_DN3_D_N, USB2_DN3_D_P, USB2_DN4_D_N, USB2_DN4_D_P, USB3_RXDN1_D_N, USB3_RXDN1_D_P, USB3_RXDN2_D_N, USB3_RXDN2_D_P, USB3_RXDN3_D_N, USB3_RXDN3_D_P, USB3_RXDN4_D_N, USB3_RXDN4_D_P, USB3_TXDN1_D_N, USB3_TXDN1_D_P, USB3_TXDN2_D_N, USB3_TXDN2_D_P, USB3_TXDN3_D_N, USB3_TXDN3_D_P, USB3_TXDN4_D_N, USB3_TXDN4_D_P
net class D90: U3D1_N, U3D1_P, U3D2_N, U3D2_P, U3D3_N, U3D3_P, U3D4_N, U3D4_P, USB2_DN1_D_N, USB2_DN1_D_P, USB2_DN2_D_N, USB2_DN2_D_P, USB2_DN3_D_N, USB2_DN3_D_P, USB2_DN4_D_N, USB2_DN4_D_P, USB3_RXDN1_D_N, USB3_RXDN1_D_P, USB3_RXDN2_D_N, USB3_RXDN2_D_P, USB3_RXDN3_D_N, USB3_RXDN3_D_P, USB3_RXDN4_D_N, USB3_RXDN4_D_P, USB3_TXDN1_D_N, USB3_TXDN1_D_P, USB3_TXDN2_D_N, USB3_TXDN2_D_P, USB3_TXDN3_D_N, USB3_TXDN3_D_P, USB3_TXDN4_D_N, USB3_TXDN4_D_P
net class HS: U3D1_N, U3D1_P, U3D2_N, U3D2_P, U3D3_N, U3D3_P, U3D4_N, U3D4_P, USB3_RXDN1_D_N, USB3_RXDN1_D_P, USB3_RXDN2_D_N, USB3_RXDN2_D_P, USB3_RXDN3_D_N, USB3_RXDN3_D_P, USB3_RXDN4_D_N, USB3_RXDN4_D_P, USB3_TXDN1_D_N, USB3_TXDN1_D_P, USB3_TXDN2_D_N, USB3_TXDN2_D_P, USB3_TXDN3_D_N, USB3_TXDN3_D_P, USB3_TXDN4_D_N, USB3_TXDN4_D_P
net class USB3_1: U3D1_N, U3D1_P, USB2_DN1_D_N, USB2_DN1_D_P, USB3_RXDN1_D_N, USB3_RXDN1_D_P, USB3_TXDN1_D_N, USB3_TXDN1_D_P
net class USB3_2: U3D2_N, U3D2_P, USB2_DN2_D_N, USB2_DN2_D_P, USB3_RXDN2_D_N, USB3_RXDN2_D_P, USB3_TXDN2_D_N, USB3_TXDN2_D_P

### Notes on the sheet
- Title:
- Number:
- Rev.
- Date:
- A4
- Copyright:
- Page
- of
- Filename:
- (in symbol 27271, part A) Port A
- (in symbol 27271, part B) Port B

### Library data of the parts
C3-C10 = 24915: as C69 on sheet PCIe; Case: 0603 (0201); Tolerance: 10%
C39 C82 = 24719: KON 4.7µF 6.3V X5R SMD 20%; AN: 24719; Mixed: SMT; Value: 4.7u; Preferred: Yes; Case: 1005 (0402); Tolerance: 20%
C40 C83-C85 C257-C260 = 26278: KON 100µF 10V X5R SMD 20%; AN: 26278; Mixed: SMT; Value: 100u; Preferred: Yes; Case: 3216 (1206); Tolerance: 20%
C149 = 22679: KON 100pF 1000V X7R 10%; AN: 22679; Value: 100p; Preferred: Yes; Mixed: SMT; Case: 3216 (1206); Tolerance: 10%
C261 = 23951: KON 15pF NPO 50V SMD; AN: 23951; Value: 15p; Mixed: SMT; Preferred: Yes; Case: 1005 (0402)
J7 = 27271: AN: 27271; Mixed: THT; Trenz-Stock: Yes; HelpURL: B:\AD\adlib\datasheet\7497110616; H-ART: 7497110616
J8 = 27248: Stiftleiste USB3 Wanne 19polig 0°; AN: 27248; Mixed: THT; Trenz-Stock: Yes; HelpURL: B:\AD\adlib\datasheet\INTEL_USB3_0
R3 R64 R69 R70 R106 R110 R111 R145 = 22750: as R29 on sheet TEBF0808; Tolerance: 1%; Case: 1005 (0402); Technology: TK100; Value: 10K
R143 = 22757: WID SMD 1M 5% 0,25W; AN: 22757; Mixed: SMT; Preferred: Yes; Case: 3216 (1206); Value: 1M; Tolerance: 5%; Technology: TK100
TP1 = 25063: AN: 25063; Mixed: SMT
U11 U49-U51 = 25369: as U20 on sheet DP_PS; Case: TSLP-9-1; HelpURL: B:\AD\adlib\datasheet\ESD3V3U4ULC; H-ART: ESD3V3U4ULC E6327
U14 U21 = 27612: AN: 27612; Mixed: SMT; Case: SO8; HelpURL: b:\AD\adlib\datasheet\AP21x6\; H-ART: AP2186SG-13

## Sheet USB.schdoc: TEBF0808 - USB
size A4; DocumentNumber: TEBF0808; Revision: 04; SheetNumber: 14; SheetTotal: 36; Date: 2016-09-29; CompanyName: Trenz Electronic GmbH; Organization: Trenz Electronic GmbH
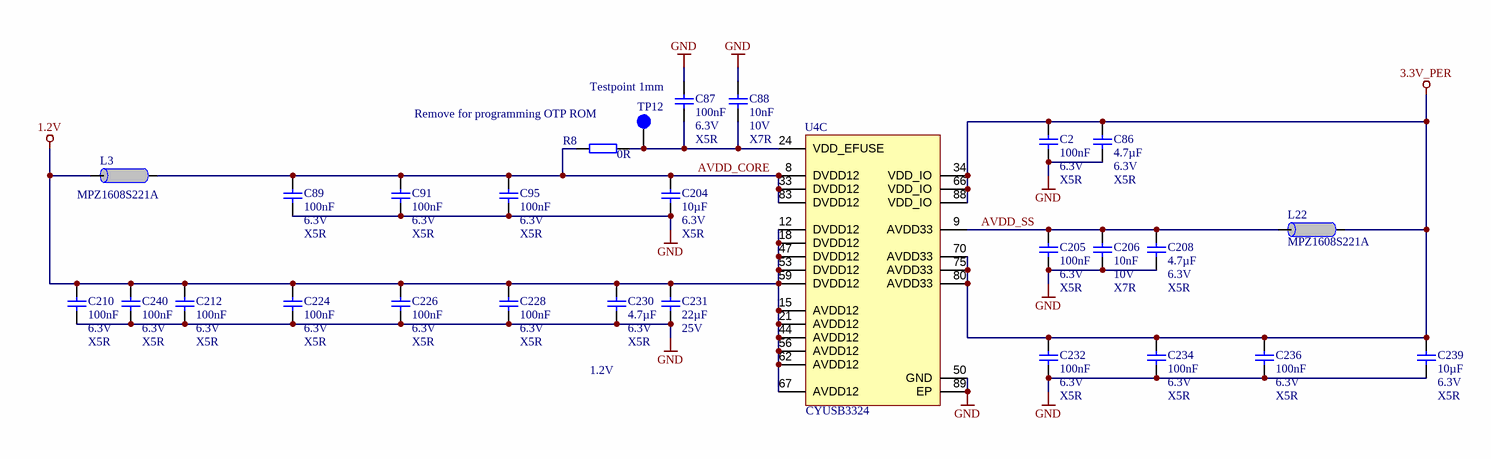
[diagram p5: USB.schdoc]

### Parts
C2  100nF  Voltage: 6.3V  Technology: X5R  [CAPC0603X33N]
C86  4.7µF  Voltage: 6.3V  Technology: X5R  [CAPC1005X60N]
C87  100nF  Voltage: 6.3V  Technology: X5R  [CAPC0603X33N]
C88  10nF  Voltage: 10V  Technology: X7R  [CAPC0603X33N]
C89  100nF  Voltage: 6.3V  Technology: X5R  [CAPC0603X33N]
C91  100nF  Voltage: 6.3V  Technology: X5R  [CAPC0603X33N]
C95  100nF  Voltage: 6.3V  Technology: X5R  [CAPC0603X33N]
C204  10µF  Voltage: 6.3V  Technology: X5R  [CAPC1608X90N]
C205  100nF  Voltage: 6.3V  Technology: X5R  [CAPC0603X33N]
C206  10nF  Voltage: 10V  Technology: X7R  [CAPC0603X33N]
C208  4.7µF  Voltage: 6.3V  Technology: X5R  [CAPC1005X60N]
C210  100nF  Voltage: 6.3V  Technology: X5R  [CAPC0603X33N]
C212  100nF  Voltage: 6.3V  Technology: X5R  [CAPC0603X33N]
C224  100nF  Voltage: 6.3V  Technology: X5R  [CAPC0603X33N]
C226  100nF  Voltage: 6.3V  Technology: X5R  [CAPC0603X33N]
C228  100nF  Voltage: 6.3V  Technology: X5R  [CAPC0603X33N]
C230  4.7µF  Voltage: 6.3V  Technology: X5R  [CAPC1005X60N]
C231  22µF  Voltage: 25V  [CAPC3216X180N]
C232  100nF  Voltage: 6.3V  Technology: X5R  [CAPC0603X33N]
C234  100nF  Voltage: 6.3V  Technology: X5R  [CAPC0603X33N]
C236  100nF  Voltage: 6.3V  Technology: X5R  [CAPC0603X33N]
C239  10µF  Voltage: 6.3V  Technology: X5R  [CAPC1608X90N]
C240  100nF  Voltage: 6.3V  Technology: X5R  [CAPC0603X33N]
L3  MPZ1608S221A  [INDC1608X95N]
L22  MPZ1608S221A  [INDC1608X95N]
R8  0R  [RESC1005X40N]
TP12  Testpoint 1mm  [TP_1mm]
U4  CYUSB3324  [QFN40P10X10X1-89T530]  (part C of 3)

### Nets
1.2V: C210.2 C212.2 C224.2 C226.2 C228.2 C230.1 C231.2 C240.2 L3.2 U4.12(DVDD12) U4.15(AVDD12) U4.18(DVDD12) U4.21(AVDD12) U4.44(AVDD12) U4.47(DVDD12) U4.53(DVDD12) U4.56(AVDD12) U4.59(DVDD12) U4.62(AVDD12) U4.67(AVDD12)
3.3V_PER: C2.1 C86.2 C232.2 C234.2 C236.2 C239.1 L22.1 U4.34(VDD_IO) U4.66(VDD_IO) U4.70(AVDD33) U4.75(AVDD33) U4.80(AVDD33) U4.88(VDD_IO)
GND: C2.2 C86.1 C87.2 C88.2 C89.1 C91.1 C95.1 C204.2 C205.2 C206.2 C208.1 C210.1 C212.1 C224.1 C226.1 C228.1 C230.2 C231.1 C232.1 C234.1 C236.1 C239.2 C240.1 U4.50(GND) U4.89(EP)
AVDD_CORE: C89.2 C91.2 C95.2 C204.1 L3.1 R8.2 U4.8(DVDD12) U4.33(DVDD12) U4.83(DVDD12)
AVDD_SS: C205.1 C206.1 C208.2 L22.2 U4.9(AVDD33)
NetC87_1: C87.1 C88.1 R8.1 TP12.1 U4.24(VDD_EFUSE)

### Notes on the sheet
- (near R8) Remove for programming OTP ROM
- 1.2V
- Title:
- Number:
- Rev.
- Date:
- A4
- Copyright:
- Page
- of
- Filename:

### Library data of the parts
C2 C87 C89 C91 C95 C205 C210 C212 C224 C226 C228 C232 C234 C236 C240 = 24915: as C69 on sheet PCIe; Case: 0603 (0201); Tolerance: 10%
C86 C208 C230 = 24719: as C39 on sheet USB-CONN; Case: 1005 (0402); Tolerance: 20%
C88 C206 = 26312: KON 10nF X7R 10V SMD 10%; AN: 26312; Mixed: SMT; Value: 10n; Preferred: Yes; Case: 0603 (0201); Tolerance: 10%
C204 C239 = 22918: as C48 on sheet SFP; Case: 1608 (0603)
C231 = 24886: as C129 on sheet DP_PS; Case: 3216 (1206); Tolerance: 10%
L3 L22 = 22718: as L19 on sheet TEBF0808; Case: 1608 (0603); HelpURL: B:\AD\adlib\datasheet\MPZ1608; Preferred: Yes; H-ART: MPZ1608S221A
R8 = 22738: as R43 on sheet DP_PS; Case: 1005 (0402); Technology: TK100
TP12 = 25063: AN: 25063; Mixed: SMT
U4 = 27573: CYUSB3324-88LTXC USB 3.0 Hub; AN: 27573; Mixed: SMT; Case: QFN88; HelpURL: b:\AD\adlib\datasheet\CYUSBx30x\; H-ART: CYUSB3324-88LTXC

## Sheet USB-PHY.SchDoc: TEBF0808 - USB
size A4; Organization: Trenz Electronic GmbH; DocumentNumber: TEBF0808; Revision: 04; SheetNumber: 13; SheetTotal: 36; Date: 2016-09-29; CompanyName: Trenz Electronic GmbH
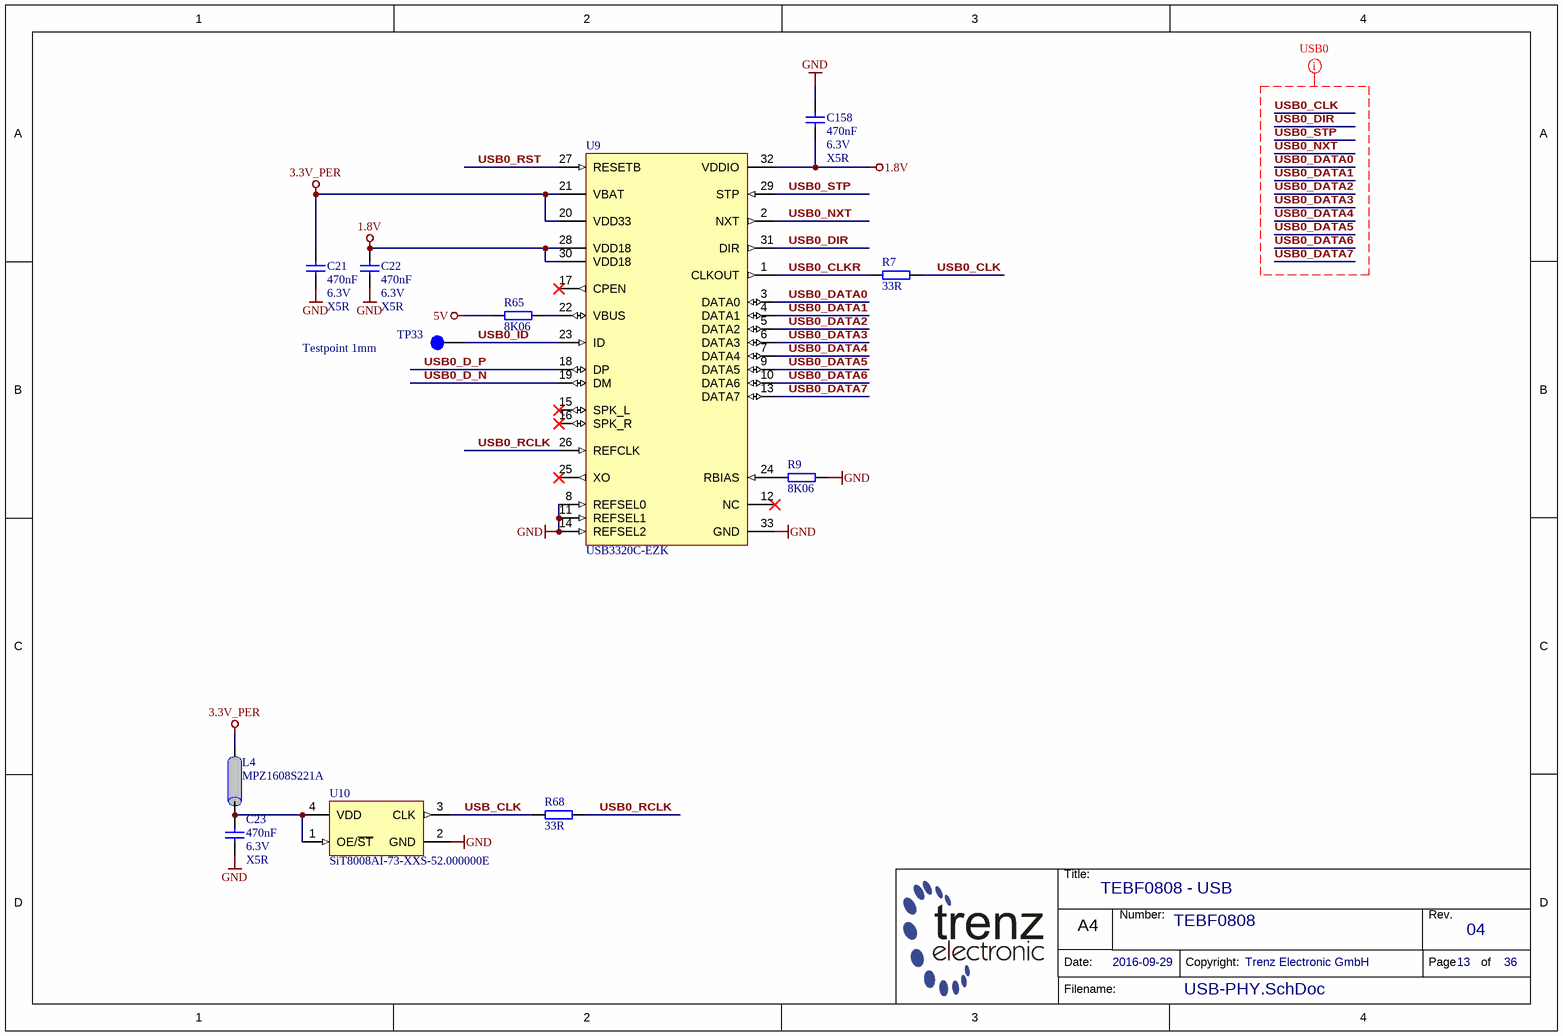
[diagram p6: USB-PHY.SchDoc]

### Parts
C21  470nF  Voltage: 6.3V  Technology: X5R  [CAPC1005X55N]
C22  470nF  Voltage: 6.3V  Technology: X5R  [CAPC1005X55N]
C23  470nF  Voltage: 6.3V  Technology: X5R  [CAPC1005X55N]
C158  470nF  Voltage: 6.3V  Technology: X5R  [CAPC1005X55N]
L4  MPZ1608S221A  [INDC1608X95N]
R7  33R  [RESC1005X40N]
R9  8K06  [RESC1005X40N]
R65  8K06  [RESC1005X40N]
R68  33R  [RESC1005X40N]
TP33  Testpoint 1mm  [TP_1mm]
U9  USB3320C-EZK  [QFN50P500X500X100-33N-345]
U10  SiT8008AI-73-XXS-52.000000E  [2016]

### Nets
1.8V: C22.1 C158.2 U9.28(VDD18) U9.30(VDD18) U9.32(VDDIO)
3.3V_PER: C21.1 L4.1 U9.20(VDD33) U9.21(VBAT)
5V: R65.1
GND: C21.2 C22.2 C23.2 C158.1 R9.2 U9.8(REFSEL0) U9.11(REFSEL1) U9.14(REFSEL2) U9.33(GND) U10.2(GND)
USB0_CLK: R7.2
USB0_CLKR: R7.1 U9.1(CLKOUT)
USB0_D_N: U9.19(DM)
USB0_D_P: U9.18(DP)
USB0_DATA0: U9.3(DATA0)
USB0_DATA1: U9.4(DATA1)
USB0_DATA2: U9.5(DATA2)
USB0_DATA3: U9.6(DATA3)
USB0_DATA4: U9.7(DATA4)
USB0_DATA5: U9.9(DATA5)
USB0_DATA6: U9.10(DATA6)
USB0_DATA7: U9.13(DATA7)
USB0_DIR: U9.31(DIR)
USB0_ID: TP33.1 U9.23(ID)
USB0_NXT: U9.2(NXT)
USB0_RCLK: R68.2 U9.26(REFCLK)
USB0_RST: U9.27(RESETB)
USB0_STP: U9.29(STP)
USB_CLK: R68.1 U10.3(CLK)
NetC23_1: C23.1 L4.2 U10.1(OE/~{ST}) U10.4(VDD)
NetR9_1: R9.1 U9.24(RBIAS)
NetR65_2: R65.2 U9.22(VBUS)

Not connected (* = marked no-connect by the designer): U9 12(NC)* 15(SPK_L)* 16(SPK_R)* 17(CPEN)* 25(XO)*

### Layout directives
net class USB0: USB0_CLK, USB0_DATA0, USB0_DATA1, USB0_DATA2, USB0_DATA3, USB0_DATA4, USB0_DATA5, USB0_DATA6, USB0_DATA7, USB0_DIR, USB0_NXT, USB0_STP

### Notes on the sheet
- Title:
- Number:
- Rev.
- Date:
- A4
- Copyright:
- Page
- of
- Filename:

### Library data of the parts
C21-C23 C158 = 23659: as C97 on sheet DP_PS; Case: 1005 (0402)
L4 = 22718: as L19 on sheet TEBF0808; Case: 1608 (0603); HelpURL: B:\AD\adlib\datasheet\MPZ1608; Preferred: Yes; H-ART: MPZ1608S221A
R7 R68 = 22770: WID SMD 33R 1% 0,063W; AN: 22770; Value: 33; Mixed: SMT; Preferred: Yes; Case: 1005 (0402); Tolerance: 1%; Technology: TK100
R9 R65 = 25052: WID SMD 8K06 1% 0,063W; AN: 25052; Value: 8.06K; Mixed: SMT; Preferred: Yes; Case: 1005 (0402); Tolerance: 1%; Technology: TK100
TP33 = 25063: AN: 25063; Mixed: SMT
U9 = 24992: AN: 24992; Trenz-Stock: Yes; Mixed: SMT; Case: QFN32; HelpURL: B:\AD\adlib\datasheet\USB3320; H-ART: USB3320C-EZK
U10 = 25009: SiT8008AI-73-XXS-52.000000E MEMS Oszillator 52MHz; AN: 25009; Value: 52M; Trenz-Stock: Yes; Mixed: SMT; Case: 2.0  x 1.6mm; HelpURL: B:\AD\adlib\datasheet\SiT8008; Preferred: Yes; H-ART: SiT8008AI-73-XXS-52.000000E

## Sheet ETH-PHY.SchDoc: TEBF0808 - ETHERNET
size A4; Organization: Trenz Electronic GmbH; DocumentNumber: TEBF0808; Revision: 04; SheetNumber: 20; SheetTotal: 36; Date: 2016-09-29; CompanyName: Trenz Electronic GmbH
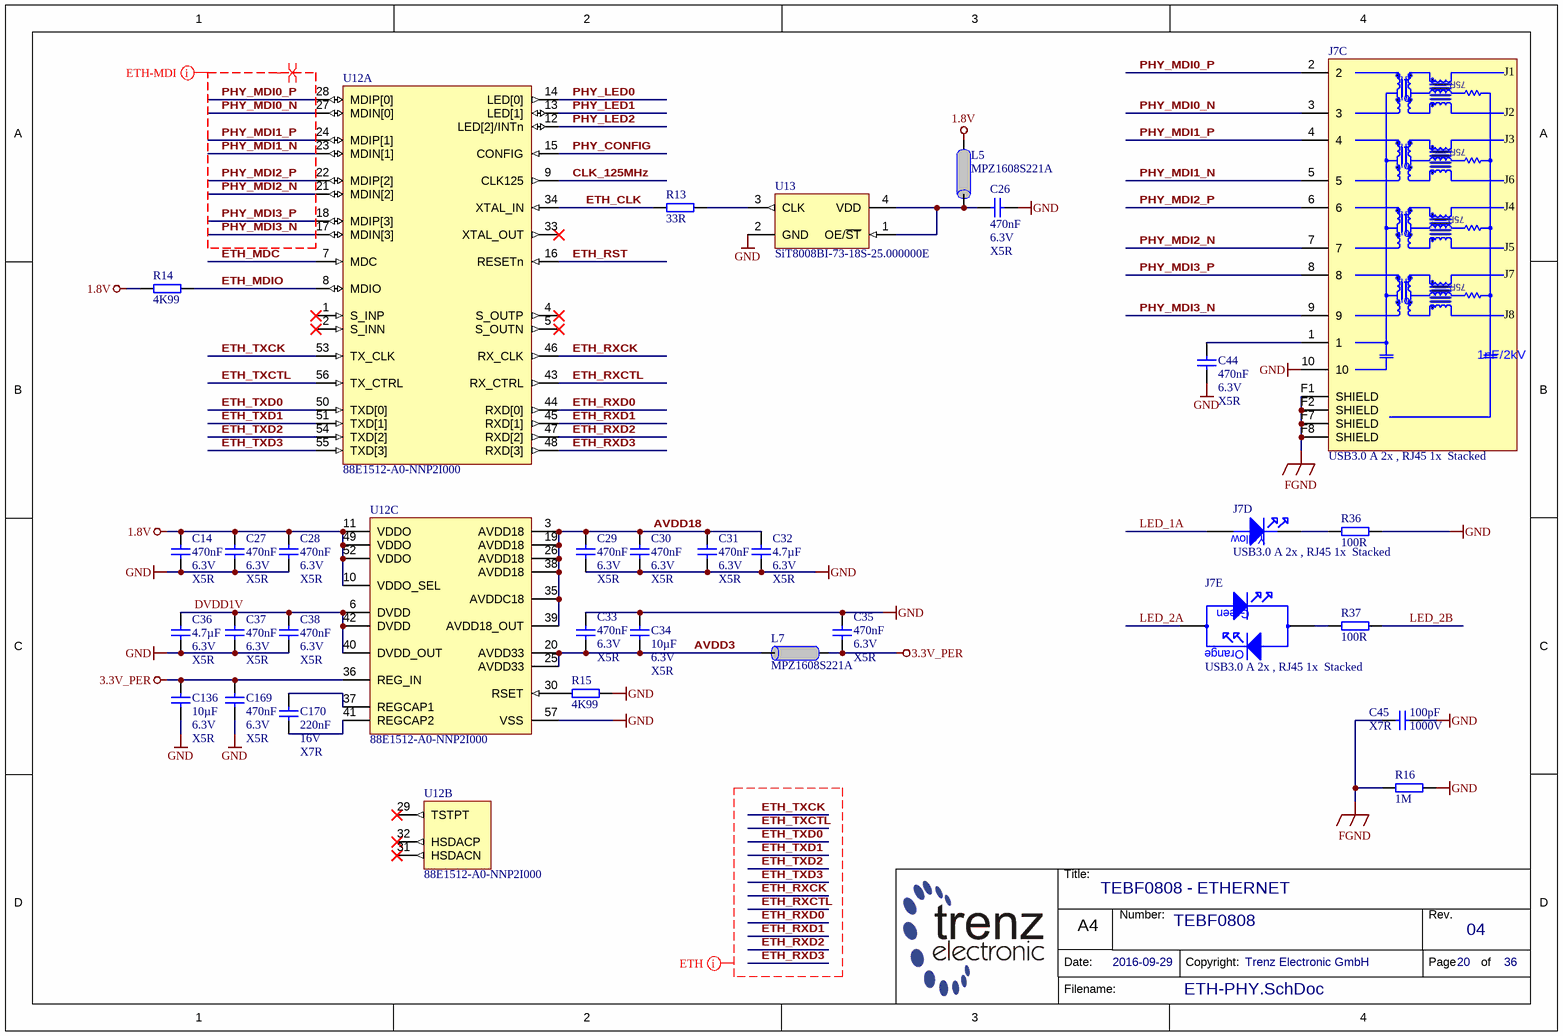
[diagram p7: ETH-PHY.SchDoc]

### Parts
C14  470nF  Voltage: 6.3V  Technology: X5R  [CAPC1005X55N]
C26  470nF  Voltage: 6.3V  Technology: X5R  [CAPC1005X55N]
C27  470nF  Voltage: 6.3V  Technology: X5R  [CAPC1005X55N]
C28  470nF  Voltage: 6.3V  Technology: X5R  [CAPC1005X55N]
C29  470nF  Voltage: 6.3V  Technology: X5R  [CAPC1005X55N]
C30  470nF  Voltage: 6.3V  Technology: X5R  [CAPC1005X55N]
C31  470nF  Voltage: 6.3V  Technology: X5R  [CAPC1005X55N]
C32  4.7µF  Voltage: 6.3V  Technology: X5R  [CAPC1005X60N]
C33  470nF  Voltage: 6.3V  Technology: X5R  [CAPC1005X55N]
C34  10µF  Voltage: 6.3V  Technology: X5R  [CAPC1608X90N]
C35  470nF  Voltage: 6.3V  Technology: X5R  [CAPC1005X55N]
C36  4.7µF  Voltage: 6.3V  Technology: X5R  [CAPC1005X60N]
C37  470nF  Voltage: 6.3V  Technology: X5R  [CAPC1005X55N]
C38  470nF  Voltage: 6.3V  Technology: X5R  [CAPC1005X55N]
C44  470nF  Voltage: 6.3V  Technology: X5R  [CAPC1005X55N]
C45  100pF  Voltage: X7R  Technology: 1000V  [CAPC3216X180N]
C136  10µF  Voltage: 6.3V  Technology: X5R  [CAPC1608X90N]
C169  470nF  Voltage: 6.3V  Technology: X5R  [CAPC1005X55N]
C170  220nF  Voltage: 16V  Technology: X7R  [CAPC1005X55N]
J7  USB3.0 A 2x , RJ45 1x  Stacked  [7497110616]  (parts C,D,E of 5)
L5  MPZ1608S221A  [INDC1608X95N]
L7  MPZ1608S221A  [INDC1608X95N]
R13  33R  [RESC1005X40N]
R14  4K99  [RESC1005X40N]
R15  4K99  [RESC1005X40N]
R16  1M  [RESC3216X65N]
R36  100R  [RESC1005X40N]
R37  100R  [RESC1005X40N]
U12  88E1512-A0-NNP2I000  [QFN50P800X800X100-57N]  (parts A,B,C of 3)
U13  SiT8008BI-73-18S-25.000000E  [2016]

### Nets
1.8V: C14.1 C27.1 C28.1 L5.1 R14.1 U12.10(VDDO_SEL) U12.11(VDDO) U12.49(VDDO) U12.52(VDDO)
3.3V_PER: C35.2 C136.1 C169.1 L7.1 U12.36(REG_IN)
FGND: C45.1 J7.F1(SHIELD) J7.F2(SHIELD) J7.F7(SHIELD) J7.F8(SHIELD) R16.1
GND: C14.2 C26.2 C27.2 C28.2 C29.2 C30.2 C31.2 C32.2 C33.1 C34.1 C35.1 C36.2 C37.2 C38.2 C44.2 C45.2 C136.2 C169.2 J7.10 R15.2 R16.2 R36.2 U12.57(VSS) U13.2(GND)
AVDD3: C33.2 C34.2 L7.2 U12.20(AVDD33) U12.25(AVDD33)
AVDD18: C29.1 C30.1 C31.1 C32.1 U12.3(AVDD18) U12.19(AVDD18) U12.26(AVDD18) U12.35(AVDDC18) U12.38(AVDD18) U12.39(AVDD18_OUT)
CLK_125MHz: U12.9(CLK125)
DVDD1V: C36.1 C37.1 C38.1 U12.6(DVDD) U12.40(DVDD_OUT) U12.42(DVDD)
ETH_CLK: R13.1 U12.34(XTAL_IN)
ETH_MDC: U12.7(MDC)
ETH_MDIO: R14.2 U12.8(MDIO)
ETH_RST: U12.16(RESETn)
ETH_RXCK: U12.46(RX_CLK)
ETH_RXCTL: U12.43(RX_CTRL)
ETH_RXD0: U12.44(RXD[0])
ETH_RXD1: U12.45(RXD[1])
ETH_RXD2: U12.47(RXD[2])
ETH_RXD3: U12.48(RXD[3])
ETH_TXCK: U12.53(TX_CLK)
ETH_TXCTL: U12.56(TX_CTRL)
ETH_TXD0: U12.50(TXD[0])
ETH_TXD1: U12.51(TXD[1])
ETH_TXD2: U12.54(TXD[2])
ETH_TXD3: U12.55(TXD[3])
LED_1A: J7.12
LED_2A: J7.14
LED_2B: R37.2
PHY_CONFIG: U12.15(CONFIG)
PHY_LED0: U12.14(LED[0])
PHY_LED1: U12.13(LED[1])
PHY_LED2: U12.12(LED[2]/INTn)
PHY_MDI0_N: J7.3 U12.27(MDIN[0])
PHY_MDI0_P: J7.2 U12.28(MDIP[0])
PHY_MDI1_N: J7.5 U12.23(MDIN[1])
PHY_MDI1_P: J7.4 U12.24(MDIP[1])
PHY_MDI2_N: J7.7 U12.21(MDIN[2])
PHY_MDI2_P: J7.6 U12.22(MDIP[2])
PHY_MDI3_N: J7.9 U12.17(MDIN[3])
PHY_MDI3_P: J7.8 U12.18(MDIP[3])
NetC26_1: C26.1 L5.2 U13.1(OE/~{ST}) U13.4(VDD)
NetC44_1: C44.1 J7.1
NetC170_1: C170.1 U12.37(REGCAP1)
NetC170_2: C170.2 U12.41(REGCAP2)
NetJ7_11: J7.11 R36.1
NetJ7_13: J7.13 R37.1
NetR13_2: R13.2 U13.3(CLK)
NetR15_1: R15.1 U12.30(RSET)

Not connected (* = marked no-connect by the designer): U12 1(S_INP)* 2(S_INN)* 4(S_OUTP)* 5(S_OUTN)* 29(TSTPT)* 31(HSDACN)* 32(HSDACP)* 33(XTAL_OUT)*

### Layout directives
differential pair: PHY_MDI0_N, PHY_MDI0_P, PHY_MDI1_N, PHY_MDI1_P, PHY_MDI2_N, PHY_MDI2_P, PHY_MDI3_N, PHY_MDI3_P
net class ETH-MDI: PHY_MDI0_N, PHY_MDI0_P, PHY_MDI1_N, PHY_MDI1_P, PHY_MDI2_N, PHY_MDI2_P, PHY_MDI3_N, PHY_MDI3_P
net class ETH: ETH_RXCK, ETH_RXCTL, ETH_RXD0, ETH_RXD1, ETH_RXD2, ETH_RXD3, ETH_TXCK, ETH_TXCTL, ETH_TXD0, ETH_TXD1, ETH_TXD2, ETH_TXD3

### Notes on the sheet
- Title:
- Number:
- Rev.
- Date:
- A4
- Copyright:
- Page
- of
- Filename:
- (in symbol 27271, part C) 75R; J1; J2; J3; J6; J4; J5; J8; 1nF/2kV
- (in symbol 27271, part D) Yellow
- (in symbol 27271, part E) Green; Orange

### Library data of the parts
C14 C26-C31 C33 C35 C37 C38 C169 = 23659: as C97 on sheet DP_PS; Case: 1005 (0402)
C32 C36 = 24719: as C41 on sheet TEBF0808; Case: 1005 (0402); Tolerance: 20%
C34 C136 = 22918: as C48 on sheet SFP; Case: 1608 (0603)
C44 = 23659: as C47 on sheet SFP; Case: 1005 (0402)
C45 = 22679: as C149 on sheet USB-CONN; Case: 3216 (1206); Tolerance: 10%
C170 = 22768: KON 220nF 16V X7R SMD; AN: 22768; Mixed: SMT; Value: 220n; Case: 1005 (0402)
J7 = 27271: AN: 27271; Mixed: THT; Trenz-Stock: Yes; HelpURL: B:\AD\adlib\datasheet\7497110616; H-ART: 7497110616
L5 L7 = 22718: as L19 on sheet TEBF0808; Case: 1608 (0603); HelpURL: B:\AD\adlib\datasheet\MPZ1608; Preferred: Yes; H-ART: MPZ1608S221A
R13 = 22770: WID SMD 33R 1% 0,063W; AN: 22770; Mixed: SMT; Value: 33; Preferred: Yes; Tolerance: 1%; Case: 1005 (0402); Technology: TK100
R14 = 22754: as R18 on sheet SFP; Case: 1005 (0402); Tolerance: 1%; Technology: TK100
R15 = 22754: as R27 on sheet TEBF0808; Case: 1005 (0402); Tolerance: 1%; Technology: TK100
R16 = 22757: as R143 on sheet USB-CONN; Case: 3216 (1206); Value: 1M; Tolerance: 5%; Technology: TK100
R36 R37 = 22507: as R28 on sheet TEBF0808; Case: 1005 (0402); Tolerance: 1%; Technology: TK100
U12 = 24652: AN: 24652; Trenz-Stock: Yes; Mixed: SMT; Case: QFN56; HelpURL: B:\AD\adlib\datasheet\NDA\88E1512; Preferred: Yes; H-ART: 88E1512-A0-NNP2I000
U13 = 27228: AN: 27228; Value: 25M; Mixed: SMT; Preferred: Yes; Voltage: 1.8V; Case: 2.0  x 1.6mm; HelpURL: B:\AD\adlib\datasheet\SiT8008; H-ART: SIT8008BI-73-18S-25.000000E

## Sheet I2C_system.schdoc: TEBF0808 - I2C System
size A4; DocumentNumber: TEBF0808; Revision: 04; SheetNumber: 21; SheetTotal: 36; Date: 2016-09-29; CompanyName: Trenz Electronic GmbH; Organization: Trenz Electronic GmbH
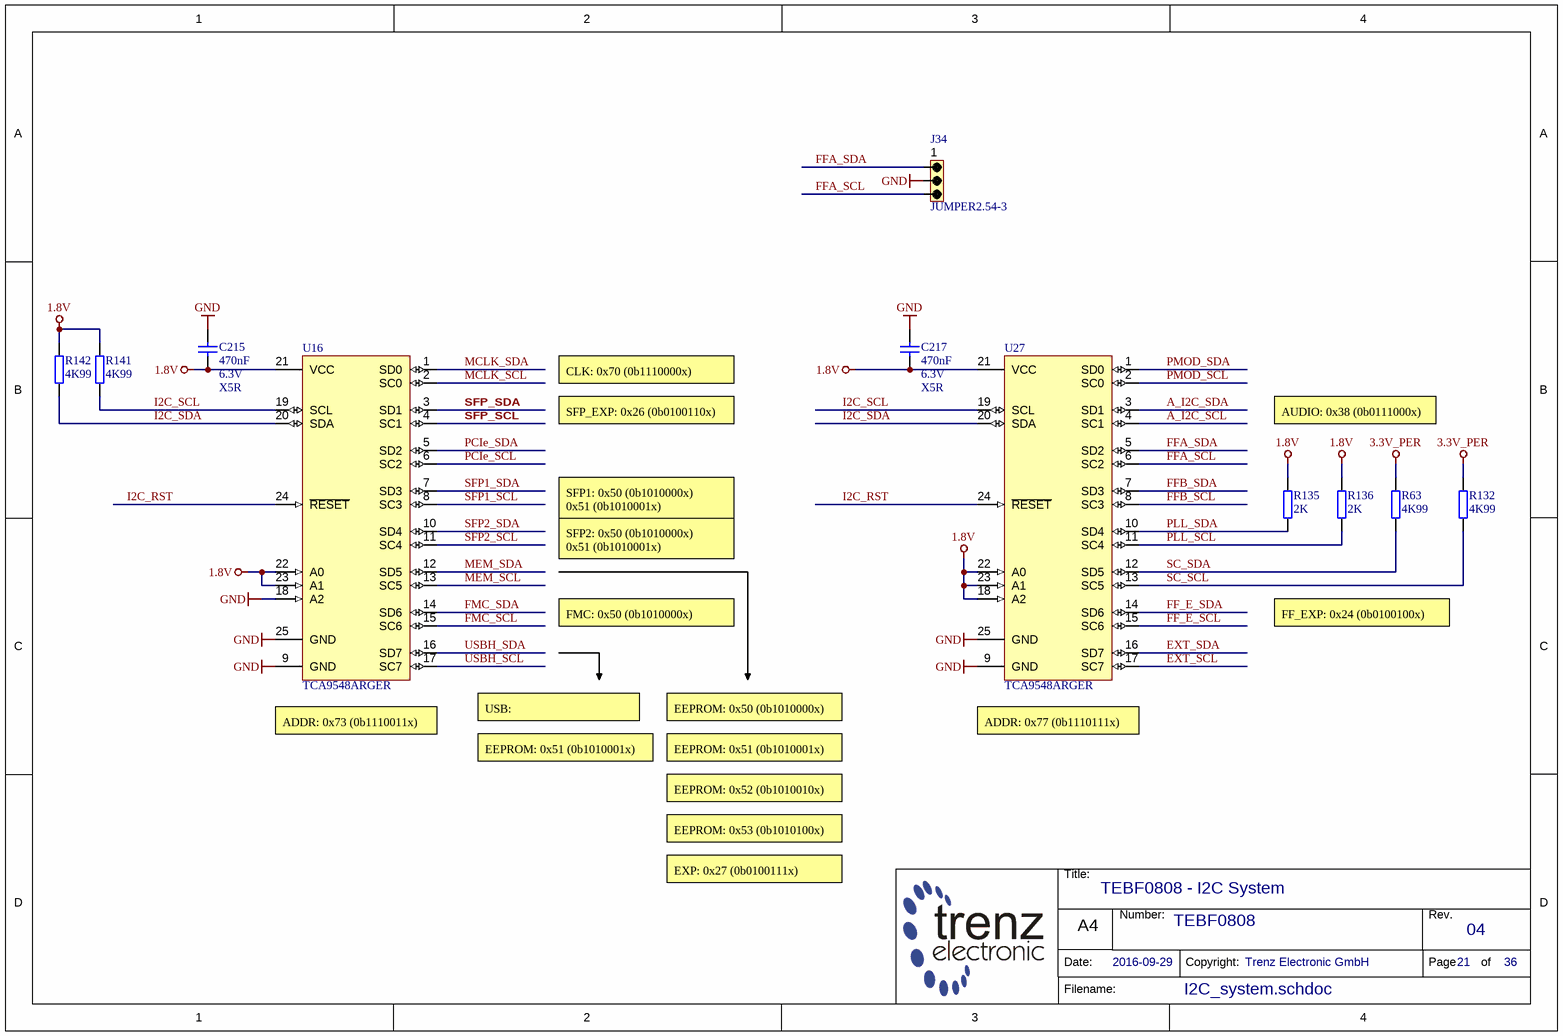
[diagram p8: I2C_system.schdoc]

### Parts
C215  470nF  Voltage: 6.3V  Technology: X5R  [CAPC1005X55N]
C217  470nF  Voltage: 6.3V  Technology: X5R  [CAPC1005X55N]
J34  JUMPER2.54-3  [JUMPER2_54-3]
R63  4K99  [RESC1005X40N]
R132  4K99  [RESC1005X40N]
R135  2K  [RESC1005X40N]
R136  2K  [RESC1005X40N]
R141  4K99  [RESC1005X40N]
R142  4K99  [RESC1005X40N]
U16  TCA9548ARGER  [QFN50P400X400X100-25N-220]
U27  TCA9548ARGER  [QFN50P400X400X100-25N-220]

### Nets
1.8V: C215.2 C217.2 R135.2 R136.2 R141.1 R142.1 U16.21(VCC) U16.22(A0) U16.23(A1) U27.18(A2) U27.21(VCC) U27.22(A0) U27.23(A1)
3.3V_PER: R63.1 R132.1
GND: C215.1 C217.1 J34.2 U16.9(GND) U16.18(A2) U16.25(GND) U27.9(GND) U27.25(GND)
A_I2C_SCL: U27.4(SC1)
A_I2C_SDA: U27.3(SD1)
EXT_SCL: U27.17(SC7)
EXT_SDA: U27.16(SD7)
FF_E_SCL: U27.15(SC6)
FF_E_SDA: U27.14(SD6)
FFA_SCL: J34.3 U27.6(SC2)
FFA_SDA: J34.1 U27.5(SD2)
FFB_SCL: U27.8(SC3)
FFB_SDA: U27.7(SD3)
FMC_SCL: U16.15(SC6)
FMC_SDA: U16.14(SD6)
I2C_RST: U16.24(~{RESET}) U27.24(~{RESET})
I2C_SCL: R141.2 U16.19(SCL) U27.19(SCL)
I2C_SDA: R142.2 U16.20(SDA) U27.20(SDA)
MCLK_SCL: U16.2(SC0)
MCLK_SDA: U16.1(SD0)
MEM_SCL: U16.13(SC5)
MEM_SDA: U16.12(SD5)
PCIe_SCL: U16.6(SC2)
PCIe_SDA: U16.5(SD2)
PLL_SCL: R136.1 U27.11(SC4)
PLL_SDA: R135.1 U27.10(SD4)
PMOD_SCL: U27.2(SC0)
PMOD_SDA: U27.1(SD0)
SC_SCL: R132.2 U27.13(SC5)
SC_SDA: R63.2 U27.12(SD5)
SFP1_SCL: U16.8(SC3)
SFP1_SDA: U16.7(SD3)
SFP2_SCL: U16.11(SC4)
SFP2_SDA: U16.10(SD4)
SFP_SCL: U16.4(SC1)
SFP_SDA: U16.3(SD1)
USBH_SCL: U16.17(SC7)
USBH_SDA: U16.16(SD7)

### Notes on the sheet
- CLK: 0x70 (0b1110000x)
- SFP_EXP: 0x26 (0b0100110x)
- AUDIO: 0x38 (0b0111000x)
- SFP1: 0x50 (0b1010000x)
  0x51 (0b1010001x)
- SFP2: 0x50 (0b1010000x)
  0x51 (0b1010001x)
- FMC: 0x50 (0b1010000x)
- FF_EXP: 0x24 (0b0100100x)
- USB:
- EEPROM: 0x50 (0b1010000x)
- (near U16) ADDR: 0x73 (0b1110011x)
- EEPROM: 0x51 (0b1010001x)
- (near U27) ADDR: 0x77 (0b1110111x)
- EEPROM: 0x53 (0b1010100x)
- EEPROM: 0x52 (0b1010010x)
- EXP: 0x27 (0b0100111x)
- Title:
- Number:
- Rev.
- Date:
- A4
- Copyright:
- Page
- of
- Filename:

### Library data of the parts
C215 C217 = 23659: as C47 on sheet SFP; Case: 1005 (0402)
J34 = 22328: Stiftleiste gerade 1-reihig, 3pol.; AN: 22328; Mixed: THT; Trenz-Stock: Yes
R63 R132 R141 R142 = 22754: as R27 on sheet TEBF0808; Case: 1005 (0402); Tolerance: 1%; Technology: TK100
R135 R136 = 25073: WID SMD 2K 1% 0,063W; AN: 25073; Mixed: SMT; Tolerance: 1%; Case: 1005 (0402); Technology: TK100; Value: 2K
U16 U27 = 26513: AN: 26513; Mixed: SMT; Case: QFN24 RGE; HelpURL: B:\ad\adlib\datasheet\TCA9548A; H-ART: TCA9548ARGER

## Sheet CLK.schdoc: TEBF0808 - CLK
size A4; DocumentNumber: TEBF0808; Revision: 04; SheetNumber: 22; SheetTotal: 36; Date: 2016-09-29; CompanyName: Trenz Electronic GmbH; Organization: Trenz Electronic GmbH
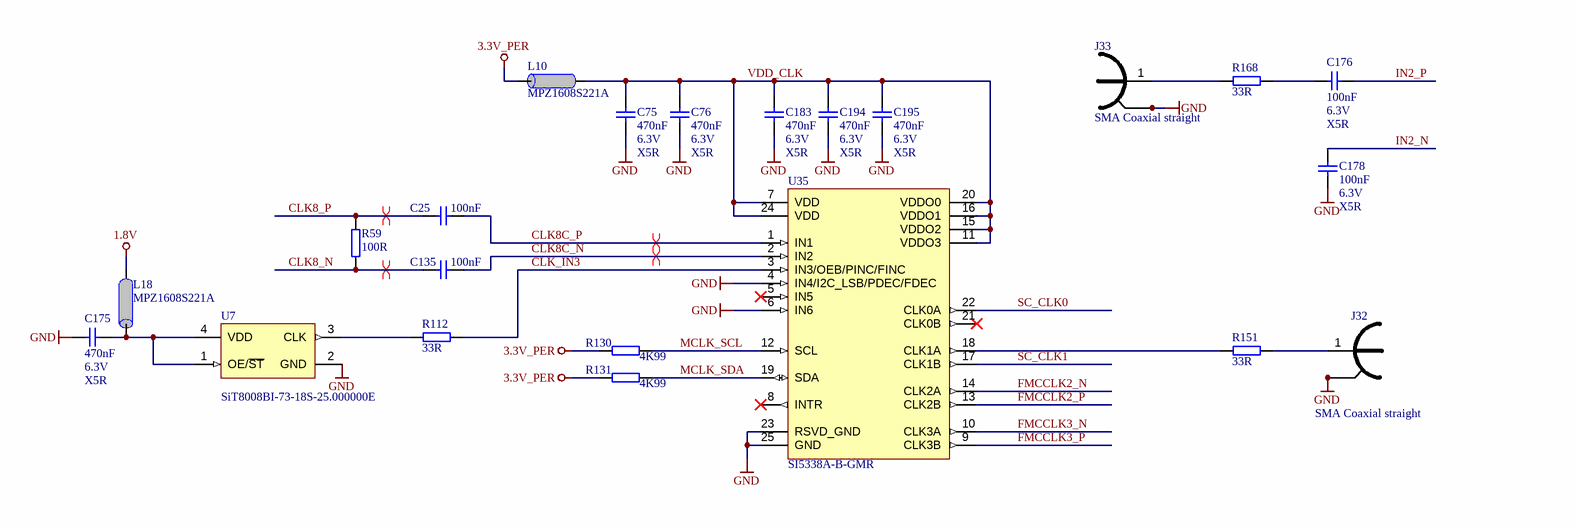
[diagram p9: CLK.schdoc]

### Parts
C25  100nF  [CAPC0603X33N]
C75  470nF  Voltage: 6.3V  Technology: X5R  [CAPC1005X55N]
C76  470nF  Voltage: 6.3V  Technology: X5R  [CAPC1005X55N]
C135  100nF  [CAPC0603X33N]
C175  470nF  Voltage: 6.3V  Technology: X5R  [CAPC1005X55N]
C176  100nF  Voltage: 6.3V  Technology: X5R  [CAPC0603X33N]
C178  100nF  Voltage: 6.3V  Technology: X5R  [CAPC0603X33N]
C183  470nF  Voltage: 6.3V  Technology: X5R  [CAPC1005X55N]
C194  470nF  Voltage: 6.3V  Technology: X5R  [CAPC1005X55N]
C195  470nF  Voltage: 6.3V  Technology: X5R  [CAPC1005X55N]
J32  SMA Coaxial straight  [SMA-R125426000]
J33  SMA Coaxial straight  [SMA-R125426000]
L10  MPZ1608S221A  [INDC1608X95N]
L18  MPZ1608S221A  [INDC1608X95N]
R59  100R  [RESC1005X40N]
R112  33R  [RESC1005X40N]
R130  4K99  [RESC1005X40N]
R131  4K99  [RESC1005X40N]
R151  33R  [RESC1005X40N]
R168  33R  [RESC1005X40N]
U7  SiT8008BI-73-18S-25.000000E  [2016]
U35  SI5338A-B-GMR  [QFN50P400X400X90-25N]

### Nets
1.8V: L18.1
3.3V_PER: L10.2 R130.1 R131.1
GND: C75.2 C76.2 C175.2 C178.1 C183.2 C194.2 C195.2 J32.2 J32.3 J32.4 J32.5 J33.2 J33.3 J33.4 J33.5 U7.2(GND) U35.4(IN4/I2C_LSB/PDEC/FDEC) U35.6(IN6) U35.23(RSVD_GND) U35.25(GND)
CLK8_N: C135.1 R59.2
CLK8_P: C25.1 R59.1
CLK8C_N: C135.2 U35.2(IN2)
CLK8C_P: C25.2 U35.1(IN1)
CLK_IN3: R112.2 U35.3(IN3/OEB/PINC/FINC)
FMCCLK2_N: U35.14(CLK2A)
FMCCLK2_P: U35.13(CLK2B)
FMCCLK3_N: U35.10(CLK3A)
FMCCLK3_P: U35.9(CLK3B)
IN2_N: C178.2
IN2_P: C176.1
MCLK_SCL: R130.2 U35.12(SCL)
MCLK_SDA: R131.2 U35.19(SDA)
SC_CLK0: U35.22(CLK0A)
SC_CLK1: U35.17(CLK1B)
VDD_CLK: C75.1 C76.1 C183.1 C194.1 C195.1 L10.1 U35.7(VDD) U35.11(VDDO3) U35.15(VDDO2) U35.16(VDDO1) U35.20(VDDO0) U35.24(VDD)
NetC175_1: C175.1 L18.2 U7.1(OE/~{ST}) U7.4(VDD)
NetC176_2: C176.2 R168.2
NetJ32_1: J32.1 R151.2
NetJ33_1: J33.1 R168.1
NetR112_1: R112.1 U7.3(CLK)
NetR151_1: R151.1 U35.18(CLK1A)

Not connected (* = marked no-connect by the designer): U35 5(IN5)* 8(INTR)* 21(CLK0B)*

### Layout directives
differential pair: CLK8_N, CLK8_P, CLK8C_N, CLK8C_P

### Notes on the sheet
- Title:
- Number:
- Rev.
- Date:
- A4
- Copyright:
- Page
- of
- Filename:

### Library data of the parts
C25 C135 C176 C178 = 24915: as C69 on sheet PCIe; Case: 0603 (0201); Tolerance: 10%
  C25 C135: Voltage: 6.3V; Technology: X5R
C75 C76 C175 C183 C194 C195 = 23659: as C97 on sheet DP_PS; Case: 1005 (0402)
J32 J33 = 22825: AN: 22825; Mixed: THT; Trenz-Stock: Yes; H-ART: R125426000; HelpURL: B:\AD\adlib\datasheet\R125426000
L10 L18 = 22718: as L19 on sheet TEBF0808; Case: 1608 (0603); HelpURL: B:\AD\adlib\datasheet\MPZ1608; Preferred: Yes; H-ART: MPZ1608S221A
R59 = 22507: as R28 on sheet TEBF0808; Tolerance: 1%; Case: 1005 (0402); Technology: TK100
R112 R151 R168 = 22770: as R13 on sheet ETH-PHY; Tolerance: 1%; Case: 1005 (0402); Technology: TK100
R130 R131 = 22754: as R27 on sheet TEBF0808; Case: 1005 (0402); Tolerance: 1%; Technology: TK100
U7 = 27228: as U13 on sheet ETH-PHY; Case: 2.0  x 1.6mm; HelpURL: B:\AD\adlib\datasheet\SiT8008; H-ART: SIT8008BI-73-18S-25.000000E
U35 = 25121: SI5338A-B-GM; AN: 25121; Mixed: SMT; Trenz-Stock: Yes; Case: QFN24; HelpURL: B:\AD\adlib\datasheet\SI5338A; Preferred: Yes; H-ART: SI5338A-B-GM